# EAGLE board botball_v5 (EAGLE 6.5.0), part 1 of 5
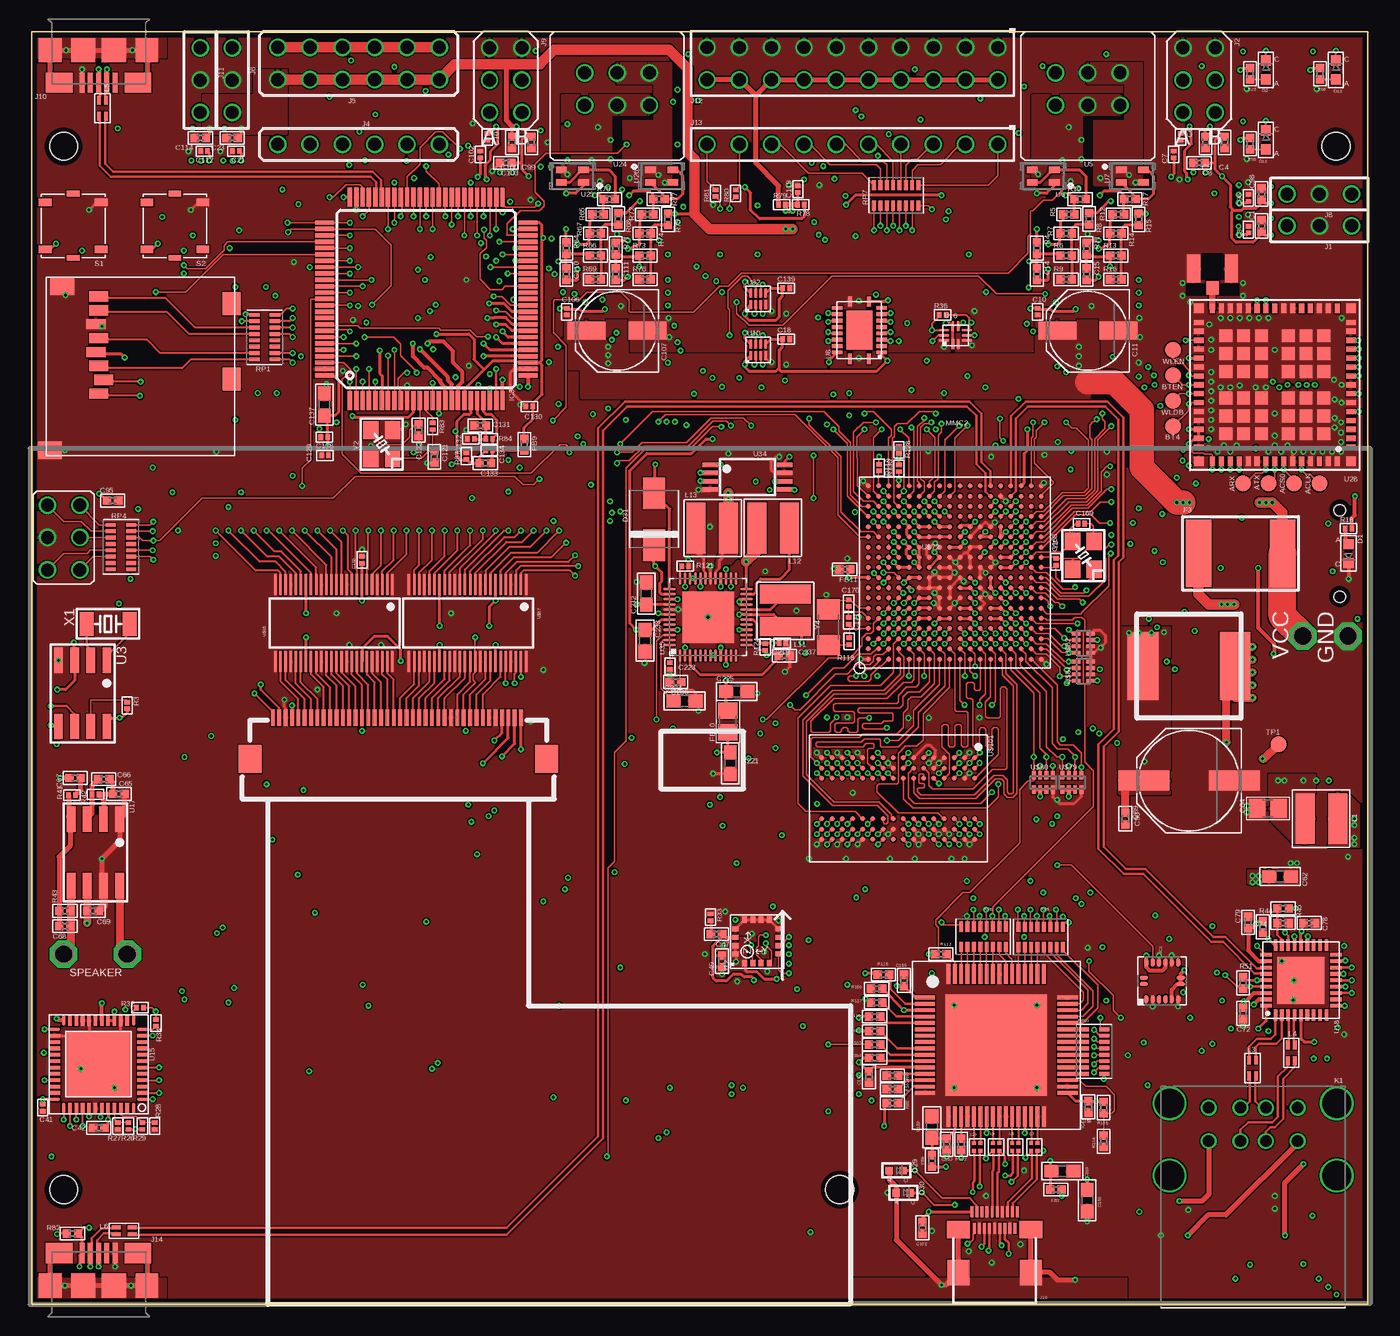
[diagram p44: board, top side]
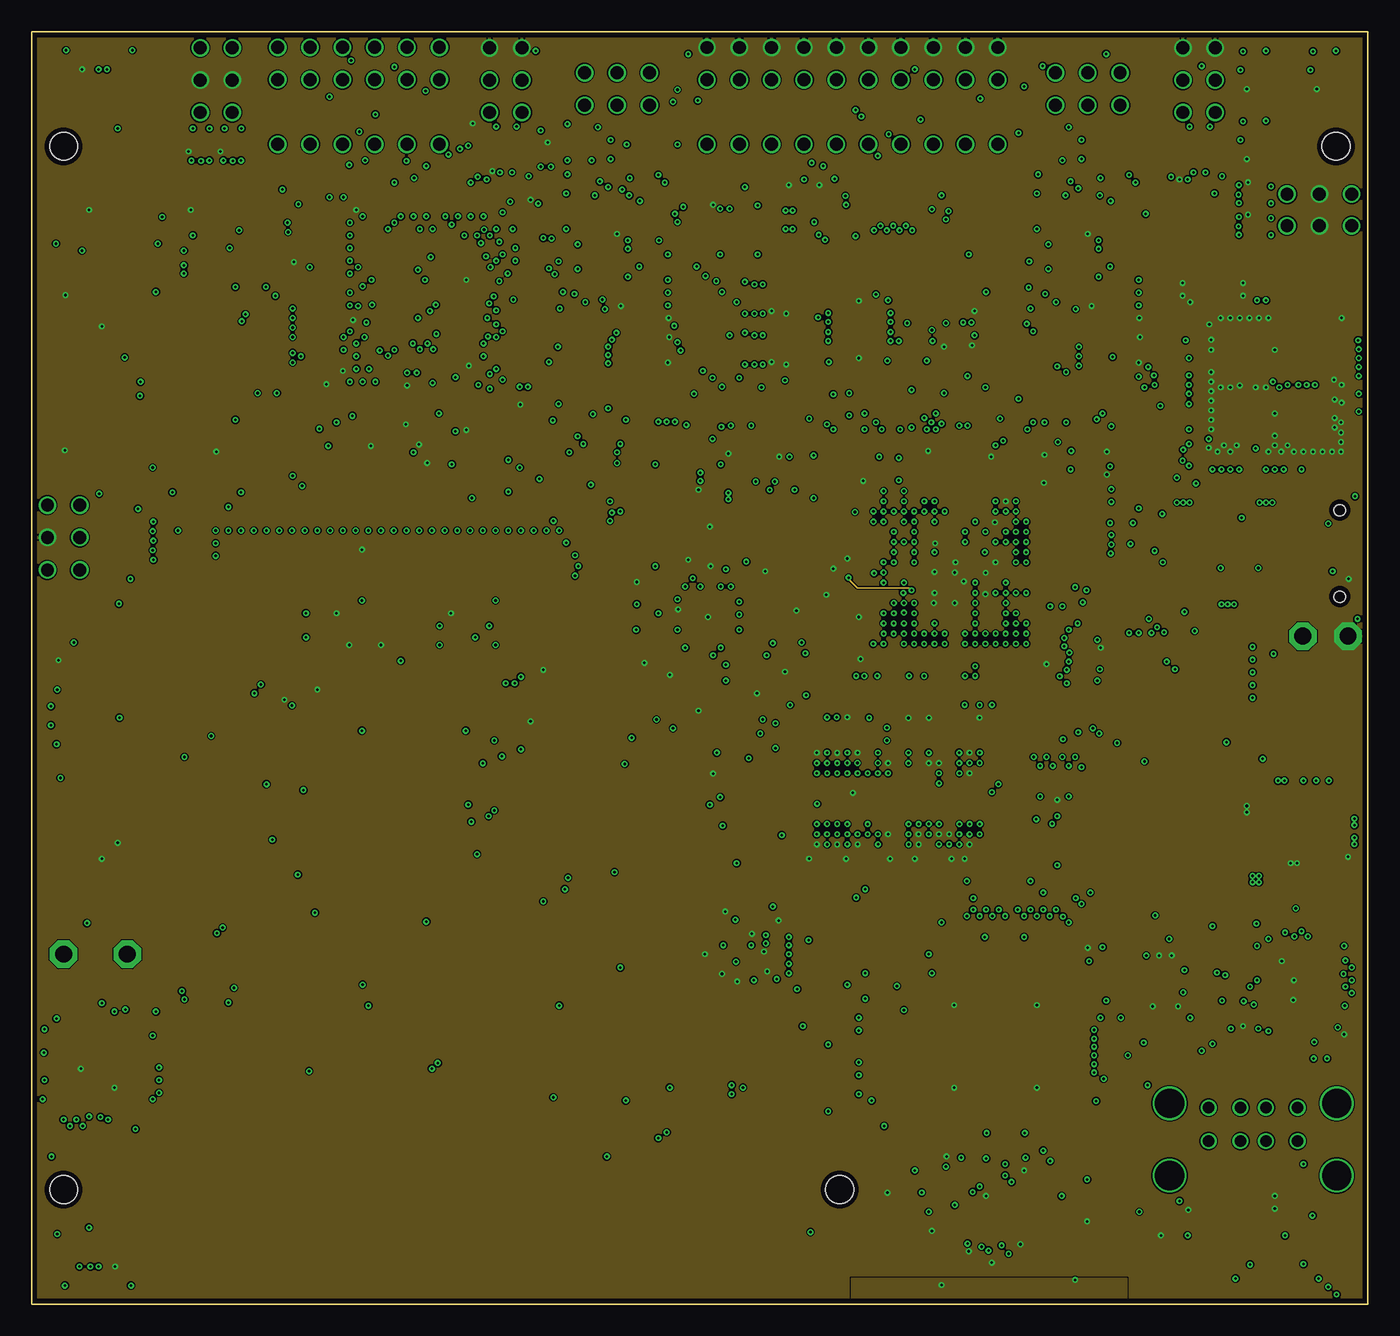
[diagram p45: board, inner layer GND]
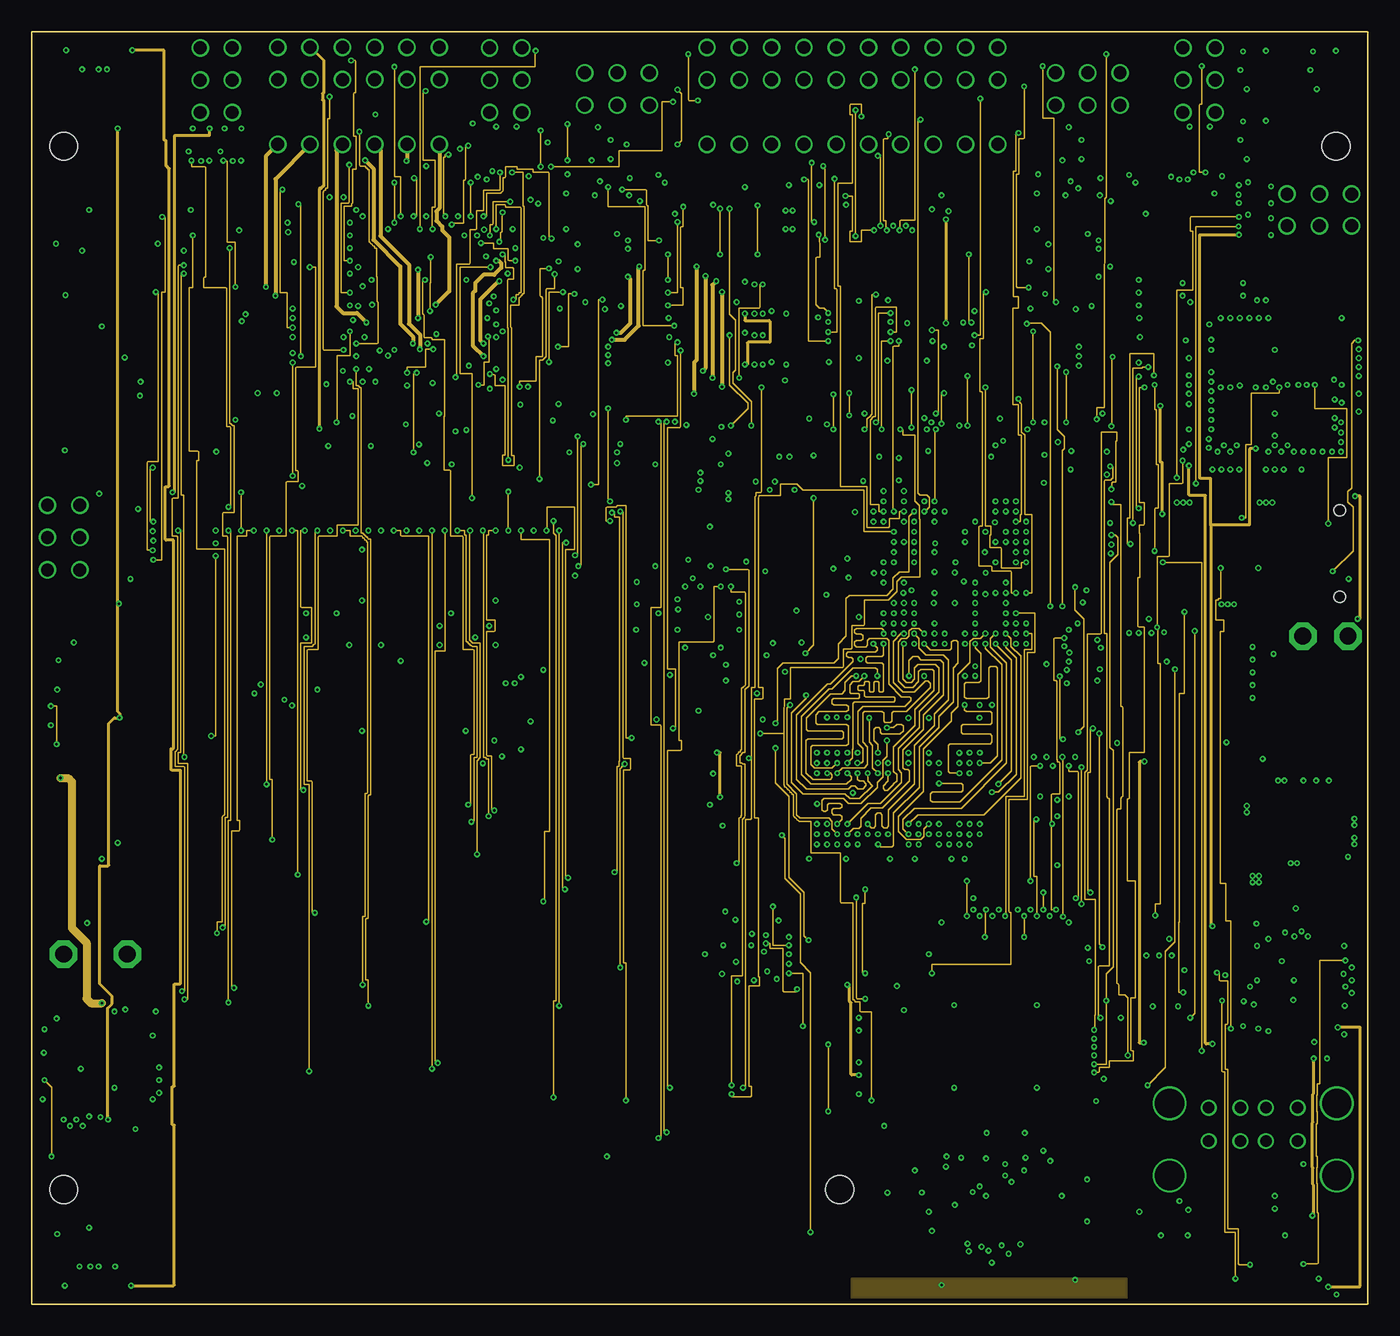
[diagram p46: board, inner layer S3]
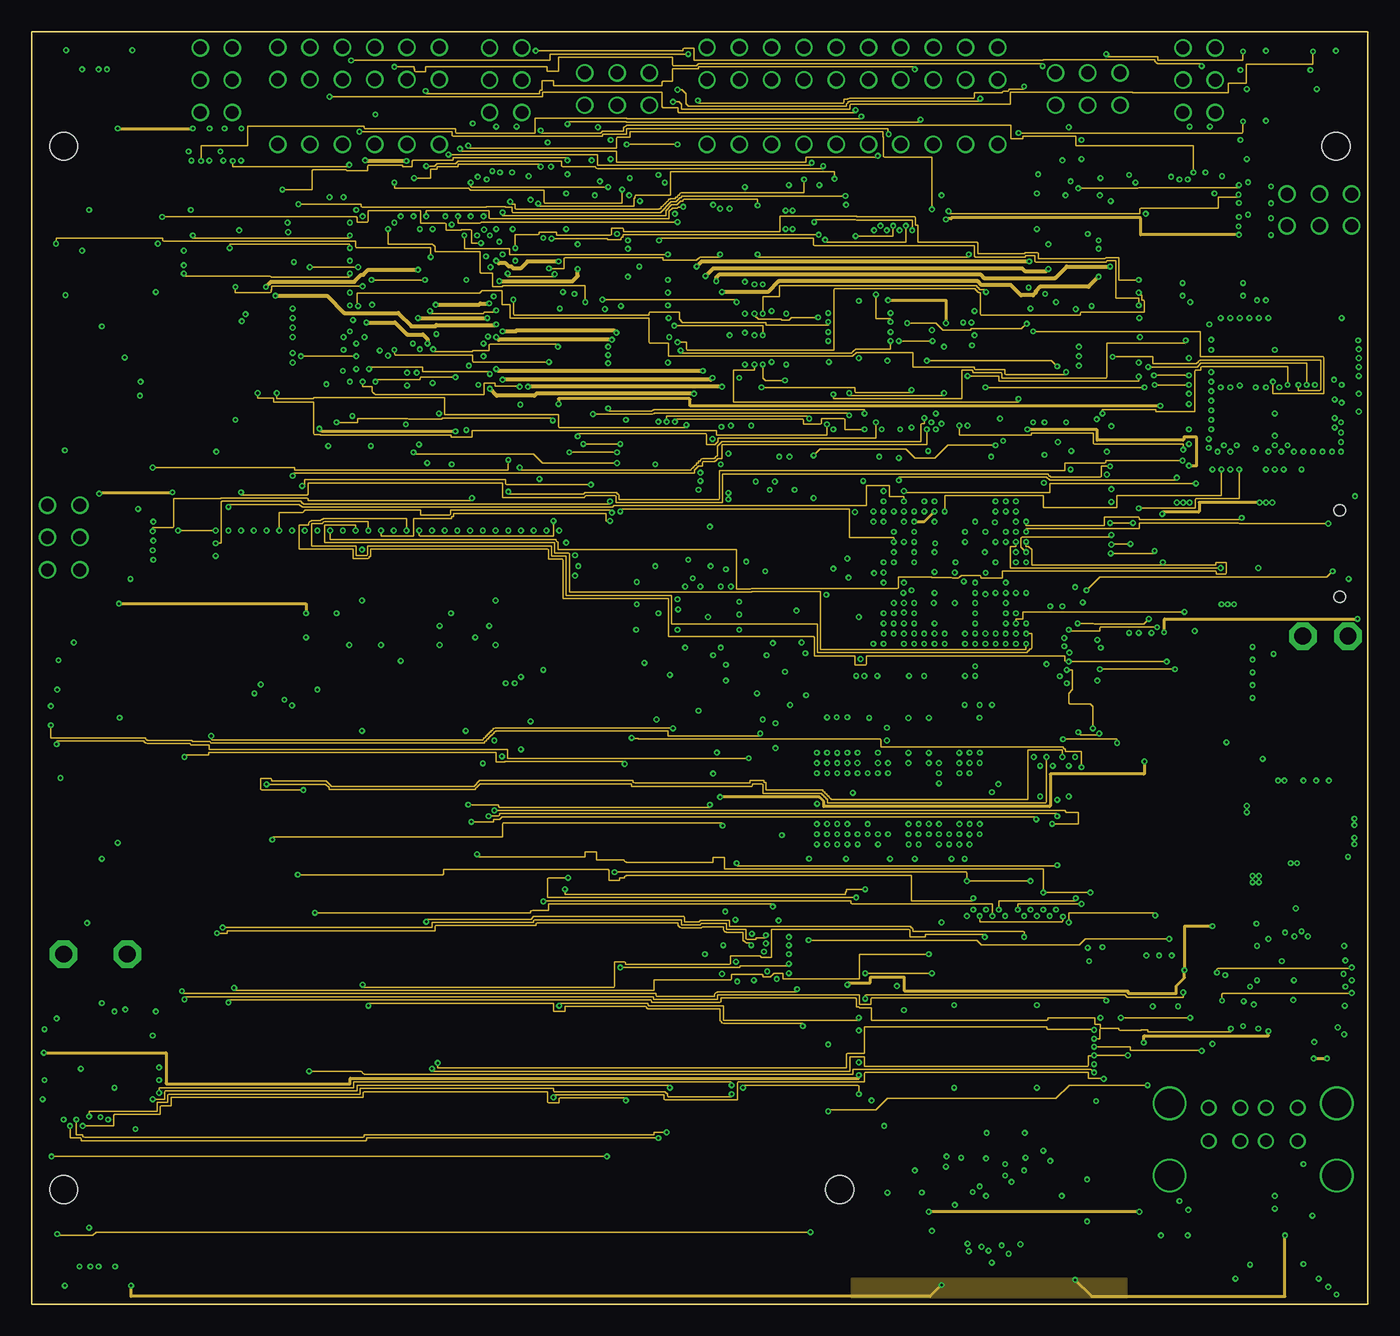
[diagram p47: board, inner layer S14]
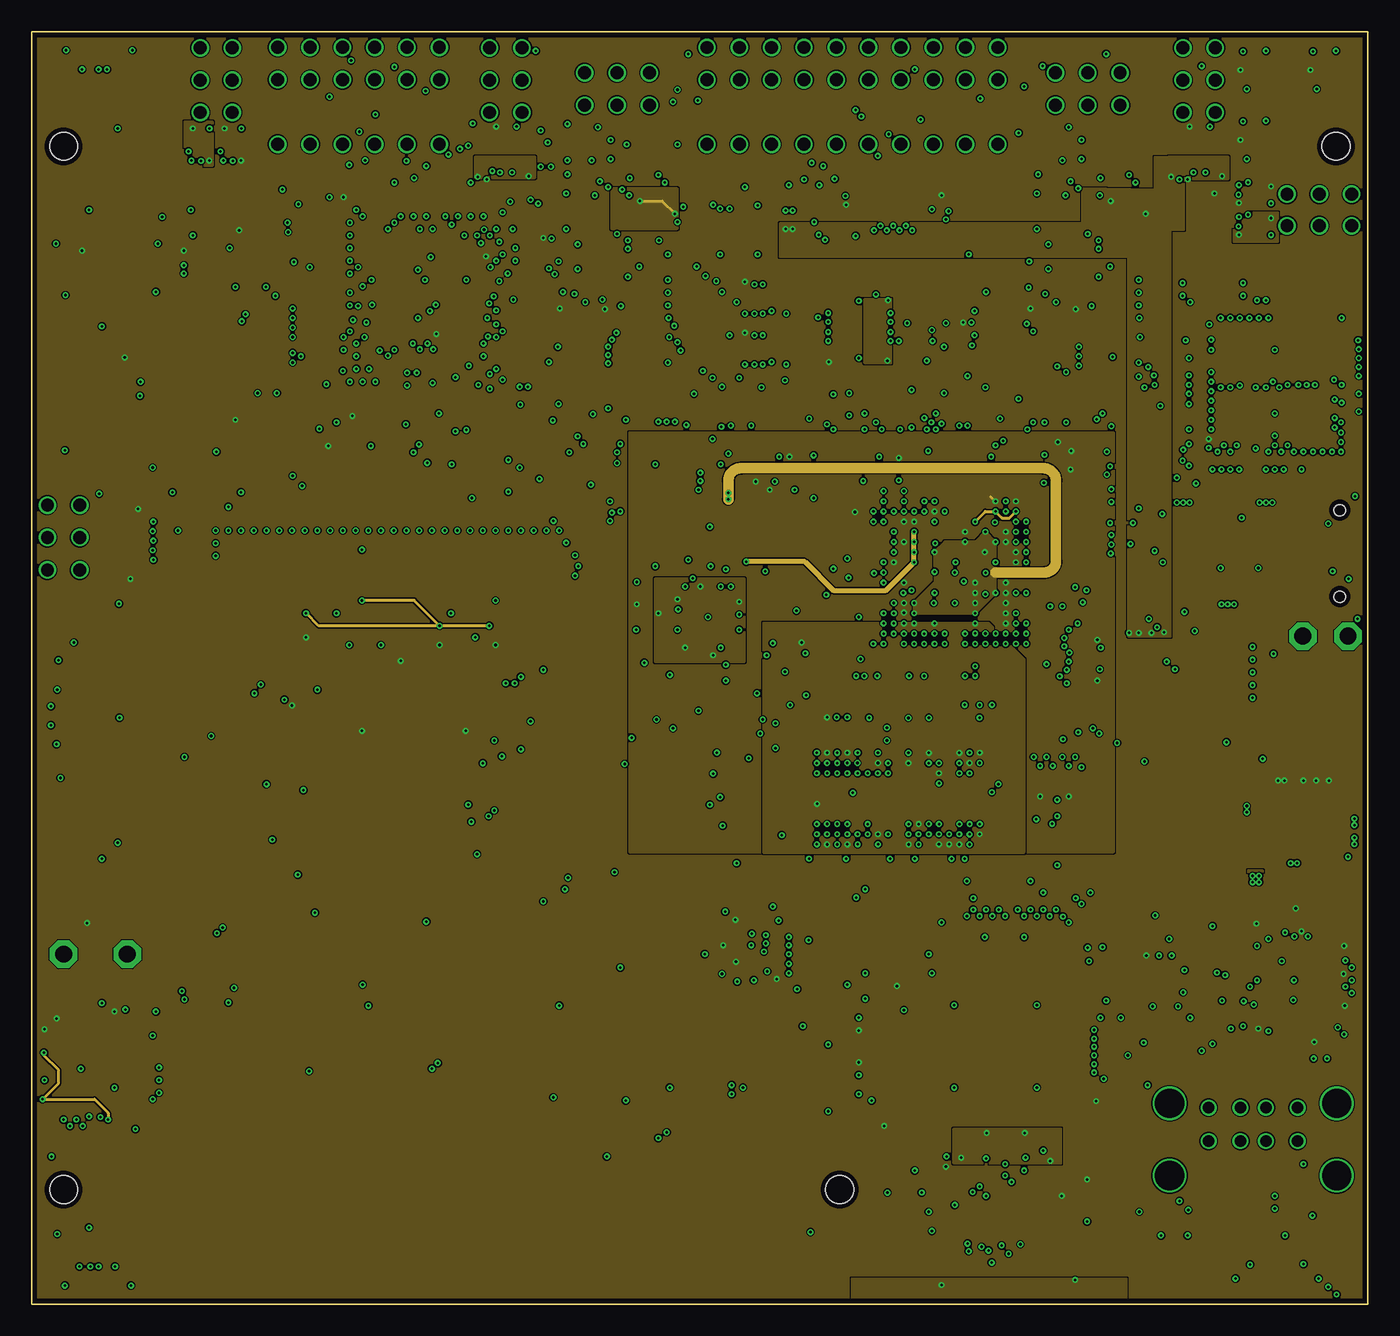
[diagram p48: board, inner layer Power]
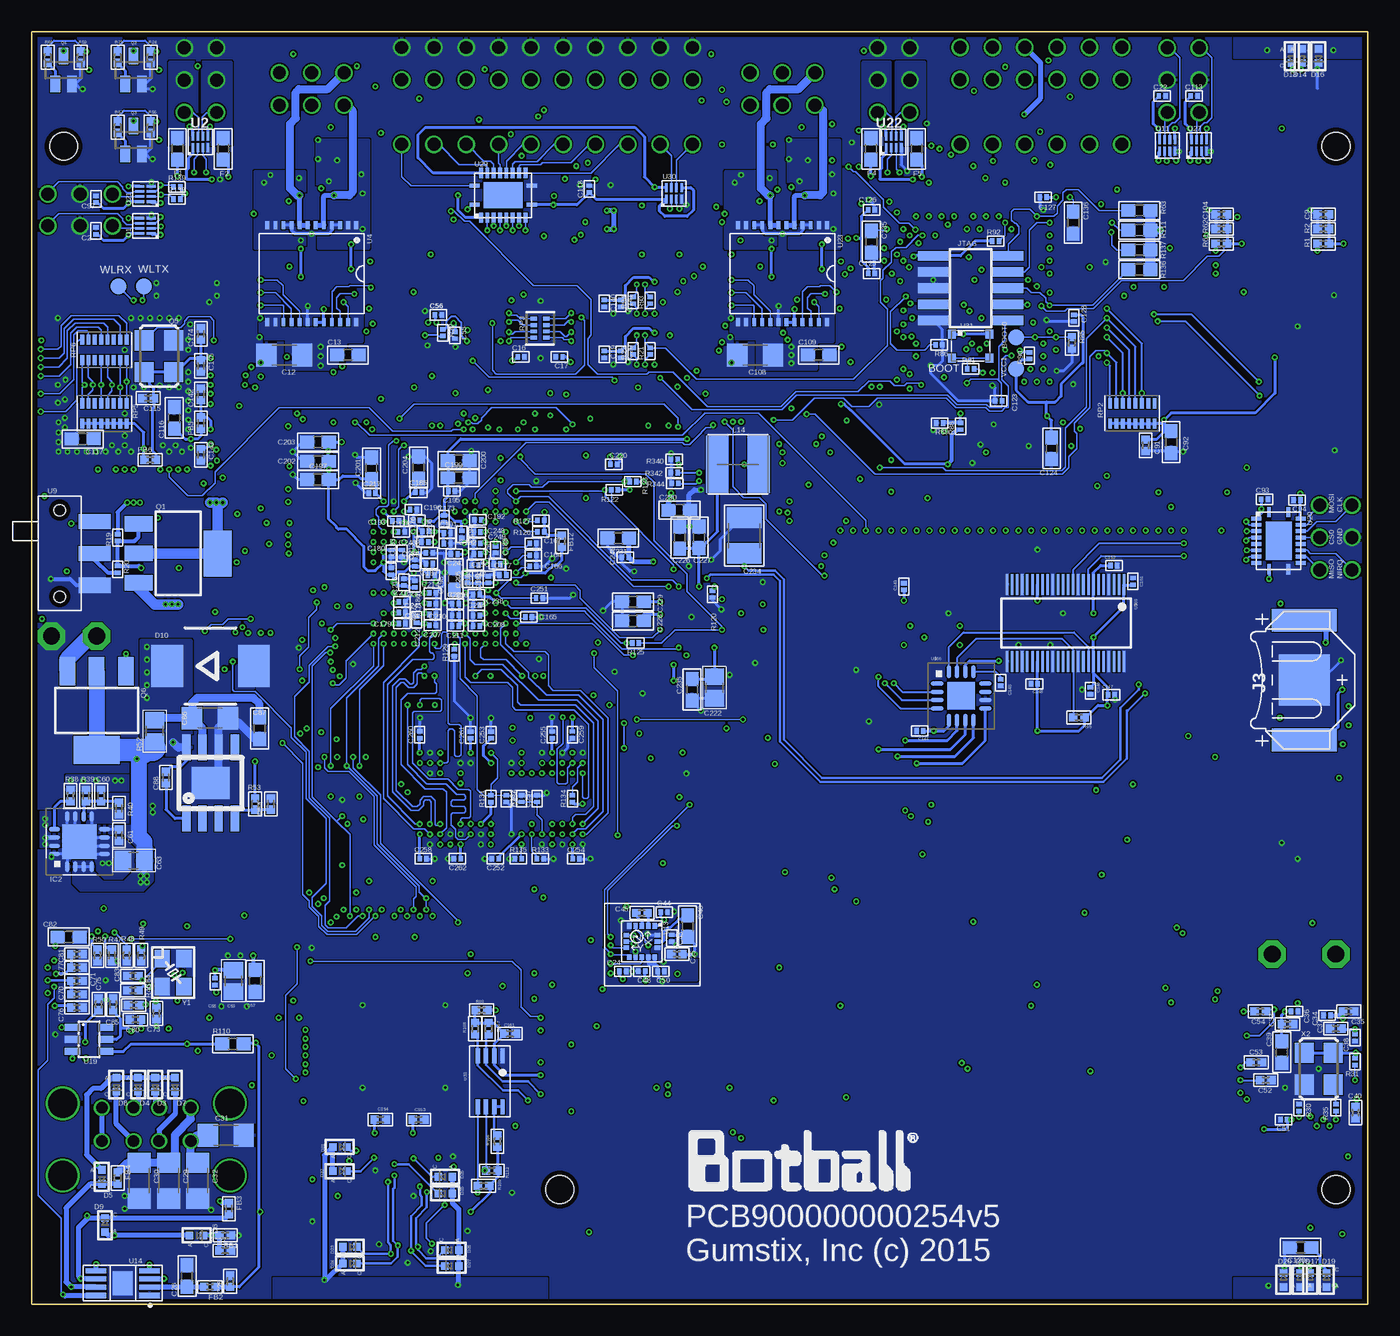
[diagram p49: board, bottom side, seen from below]

Size 105 x 100 mm. Coordinates in mm from the lower left corner, seen from the top.
Outline: 0,0 0,100 105,100 105,0 0,0
Copper layers (1+2*3+14*15+16): Top 0.035mm / dielectric 0.2mm / GND 0.035mm / dielectric 0.2mm / S3 0.035mm / dielectric 0.2mm / S14 0.035mm / dielectric 0.2mm / Power 0.035mm / dielectric 0.2mm / Bottom 0.035mm
Design rules "geppetto": minimum track width 4mil, minimum drill 8mil, track to track 4mil, track to pad 0.15mm, pad to pad 0.15mm, via to via 0.15mm, smd to smd 0mil, copper to edge 15mil, drill to drill 10mil, minimum pad ring 7mil, minimum via ring 5mil, stop-mask expansion 3mil, vias tented up to drill 20mil, thermal gap 0mil
Net classes: 1 supply: width 0.254 mm; 4 xxwide: width 0.203 mm; 5 USB: width 0.2 mm, clearance 0.2 mm; 6 HDMI: width 0.2 mm, clearance 0.3 mm
Holes 2.2 mm at 2.5,9 2.5,91 102.5,91 63.5,9
vRestrict: area 95.5,31.6 to 105,41.1; area 1,7.5 to 4,10.5; area 1,89.5 to 4,92.5; area 101,89.5 to 104,92.5; area 14.4,41.8 to 46.4,61.3; area 46.5,45.5 to 84.5,68.5; area 57.5,33.5 to 78,45.5

## Footprints (pad centres in the part's own frame; a part is rotated, then mirrored left to right if it is on the bottom)
TP0500 = smd 1.27 x 1.27: 1 0,0
0402 = smd 0.65 x 0.65: 1 -0.45,0; 2 0.45,0
0201 = smd 0.35 x 0.45: 1 -0.265,0; 2 0.265,0
PANASONIC_D = smd 3 x 1.4: + 2.4,0; - -2.4,0
1206 = smd 1.6 x 1.8: 1 -1.4,0; 2 1.4,0
0603 = smd 1.1 x 1: 1 -0.85,0; 2 0.85,0
0805 = smd 1.3 x 1.5: 1 -0.85,0; 2 0.85,0
PANASONIC_F = smd 4 x 1.6: + 3.55,0; - -3.55,0
1210 = smd 1.6 x 2.7: 1 -1.4,0; 2 1.4,0
U.FL = smd 1 x 1.05: 1 0,-1.525 | smd 1.05 x 2.2: 2 -1.475,0; 3 1.475,0
D0603 = smd 0.8 x 0.8: A -0.75,0; C 0.75,0
D0402 = smd 0.6 x 0.6: P1 0,-0.55; P2 0,0.55
DO-214AB = smd 2.5 x 3.3: A 3.4,0; C -3.4,0
SMAJ = smd 2.5 x 1.7: A 2.032,0; C -2.032,0
2920 = smd 2 x 5.3: 1 -3.3,0; 2 3.3,0
P1-13 = drill 1.321 pad 2.159 octagon: TP 0,0
EP-3X3MMQFN16 = smd 0.65 x 0.3: 1 -1.45,1.25; 2 -1.45,0.75; 3 -1.45,0.25; 4 -1.45,-0.25; 5 -1.45,-0.75; 6 -1.45,-1.25; 9 1.45,-1.25; 10 1.45,-0.75; 11 1.45,-0.25; 12 1.45,0.25; 13 1.45,0.75; 14 1.45,1.25 | smd 0.3 x 0.65: 7 -0.25,-1.45; 8 0.25,-1.45; 15 0.25,1.45; 16 -0.25,1.45
PQFP16 = smd 0.85 x 0.35: 1 -1.975,0.975; 2 -1.975,0.325; 3 -1.975,-0.325; 4 -1.975,-0.975; 9 1.975,-0.975; 10 1.975,-0.325; 11 1.975,0.325; 12 1.975,0.975 | smd 0.35 x 0.85: 5 -0.975,-1.975; 6 -0.325,-1.975; 7 0.325,-1.975; 8 0.975,-1.975; 13 0.975,1.975; 14 0.325,1.975; 15 -0.325,1.975; 16 -0.975,1.975 | smd 2.7 x 2.7: P$1 0,0
TQFP100 = smd 1.5 x 0.35: 1 -8,6; 2 -8,5.5; 3 -8,5; 4 -8,4.5; 5 -8,4; 6 -8,3.5; 7 -8,3; 8 -8,2.5; 9 -8,2; 10 -8,1.5; 11 -8,1; 12 -8,0.5; 13 -8,0; 14 -8,-0.5; 15 -8,-1; 16 -8,-1.5; 17 -8,-2; 18 -8,-2.5; 19 -8,-3; 20 -8,-3.5; 21 -8,-4; 22 -8,-4.5; 23 -8,-5; 24 -8,-5.5; 25 -8,-6; 51 8,-6; 52 8,-5.5; 53 8,-5; 54 8,-4.5; 55 8,-4; 56 8,-3.5; 57 8,-3; 58 8,-2.5; 59 8,-2; 60 8,-1.5; 61 8,-1; 62 8,-0.5; 63 8,0; 64 8,0.5; 65 8,1; 66 8,1.5; 67 8,2; 68 8,2.5; 69 8,3; 70 8,3.5; 71 8,4; 72 8,4.5; 73 8,5; 74 8,5.5; 75 8,6 | smd 0.35 x 1.5: 26 -6,-8; 27 -5.5,-8; 28 -5,-8; 29 -4.5,-8; 30 -4,-8; 31 -3.5,-8; 32 -3,-8; 33 -2.5,-8; 34 -2,-8; 35 -1.5,-8; 36 -1,-8; 37 -0.5,-8; 38 0,-8; 39 0.5,-8; 40 1,-8; 41 1.5,-8; 42 2,-8; 43 2.5,-8; 44 3,-8; 45 3.5,-8; 46 4,-8; 47 4.5,-8; 48 5,-8; 49 5.5,-8; 50 6,-8; 76 6,8; 77 5.5,8; 78 5,8; 79 4.5,8; 80 4,8; 81 3.5,8; 82 3,8; 83 2.5,8; 84 2,8; 85 1.5,8; 86 1,8; 87 0.5,8; 88 0,8; 89 -0.5,8; 90 -1,8; 91 -1.5,8; 92 -2,8; 93 -2.5,8; 94 -3,8; 95 -3.5,8; 96 -4,8; 97 -4.5,8; 98 -5,8; 99 -5.5,8; 100 -6,8
TQFP-64 = smd 1.6 x 0.3: 1 -5.6,3.75; 2 -5.6,3.25; 3 -5.6,2.75; 4 -5.6,2.25; 5 -5.6,1.75; 6 -5.6,1.25; 7 -5.6,0.75; 8 -5.6,0.25; 9 -5.6,-0.25; 10 -5.6,-0.75; 11 -5.6,-1.25; 12 -5.6,-1.75; 13 -5.6,-2.25; 14 -5.6,-2.75; 15 -5.6,-3.25; 16 -5.6,-3.75; 33 5.6,-3.75; 34 5.6,-3.25; 35 5.6,-2.75; 36 5.6,-2.25; 37 5.6,-1.75; 38 5.6,-1.25; 39 5.6,-0.75; 40 5.6,-0.25; 41 5.6,0.25; 42 5.6,0.75; 43 5.6,1.25; 44 5.6,1.75; 45 5.6,2.25; 46 5.6,2.75; 47 5.6,3.25; 48 5.6,3.75 | smd 0.3 x 1.6: 17 -3.75,-5.6; 18 -3.25,-5.6; 19 -2.75,-5.6; 20 -2.25,-5.6; 21 -1.75,-5.6; 22 -1.25,-5.6; 23 -0.75,-5.6; 24 -0.25,-5.6; 25 0.25,-5.6; 26 0.75,-5.6; 27 1.25,-5.6; 28 1.75,-5.6; 29 2.25,-5.6; 30 2.75,-5.6; 31 3.25,-5.6; 32 3.75,-5.6; 49 3.75,5.6; 50 3.25,5.6; 51 2.75,5.6; 52 2.25,5.6; 53 1.75,5.6; 54 1.25,5.6; 55 0.75,5.6; 56 0.25,5.6; 57 -0.25,5.6; 58 -0.75,5.6; 59 -1.25,5.6; 60 -1.75,5.6; 61 -2.25,5.6; 62 -2.75,5.6; 63 -3.25,5.6; 64 -3.75,5.6 | smd 8 x 8: TP 0,0
MA03-100 = drill 1.016: 1 -2.54,0; 2 0,0; 3 2.54,0
MA03-2 = drill 1.016: A1 -1.27,2.54; A2 -1.27,0; A3 -1.27,-2.54; B1 1.27,2.54; B2 1.27,0; B3 1.27,-2.54
BATTERY_6.8MM-2998 = smd 1.8 x 5.1: +1 4.7,0; +2 -4.7,0 | smd 4 x 4: - 0,0
1X06 = drill 1.016: 1 -6.35,0; 2 -3.81,0; 3 -1.27,0; 4 1.27,0; 5 3.81,0; 6 6.35,0
2X06 = drill 1.016: A1 -6.35,1.27; A2 -3.81,1.27; A3 -1.27,1.27; A4 1.27,1.27; A5 3.81,1.27; A6 6.35,1.27; B1 -6.35,-1.27; B2 -3.81,-1.27; B3 -1.27,-1.27; B4 1.27,-1.27; B5 3.81,-1.27; B6 6.35,-1.27
2X03 = drill 1.016: A1 -2.54,1.27; A2 0,1.27; A3 2.54,1.27; B1 -2.54,-1.27; B2 0,-1.27; B3 2.54,-1.27
USB_MICRO_B = smd 2.1 x 1.6: COMMON_SHEILD1 -3.1,4; COMMON_SHEILD2 3.1,4 | smd 1.8 x 1.9: COMMON_SHEILD3 -3.8,1.45; COMMON_SHEILD6 3.8,1.45 | smd 1.9 x 1.9: COMMON_SHEILD4 -1.2,1.45; COMMON_SHEILD5 1.2,1.45 | smd 0.4 x 1.6: P1 -1.3,4; P2 -0.65,4; P3 0,4; P4 0.65,4; P5 1.3,4
057-020-1 = drill 1.016: 1 -11.43,-1.27; 2 -11.43,1.27; 3 -8.89,-1.27; 4 -8.89,1.27; 5 -6.35,-1.27; 6 -6.35,1.27; 7 -3.81,-1.27; 8 -3.81,1.27; 9 -1.27,-1.27; 10 -1.27,1.27; 11 1.27,-1.27; 12 1.27,1.27; 13 3.81,-1.27; 14 3.81,1.27; 15 6.35,-1.27; 16 6.35,1.27; 17 8.89,-1.27; 18 8.89,1.27; 19 11.43,-1.27; 20 11.43,1.27
057-010-1 = drill 1.016: 1 -11.43,0; 2 -8.89,0; 3 -6.35,0; 4 -3.81,0; 5 -1.27,0; 6 1.27,0; 7 3.81,0; 8 6.35,0; 9 8.89,0; 10 11.43,0
46765-001 = smd 0.23 x 0.85: 1 1.8,7.175; 2 1.6,5.875; 3 1.4,7.175; 4 1.2,5.875; 5 1,7.175; 6 0.8,5.875; 7 0.6,7.175; 8 0.4,5.875; 9 0.2,7.175; 10 0,5.875; 11 -0.2,7.175; 12 -0.4,5.875; 13 -0.6,7.175; 14 -0.8,5.875; 15 -1,7.175; 16 -1.2,5.875; 17 -1.4,7.175; 18 -1.6,5.875; 19 -1.8,7.175 | smd 1.7 x 2: CON1 -2.85,2.4; CON2 2.85,2.4 | smd 1.8 x 1.38: CON3 2.85,5.76; CON4 -2.85,5.76
1365-10 = smd 0.76 x 2.4: 1 -2.54,-2.95; 2 -2.54,2.95; 3 -1.27,-2.95; 4 -1.27,2.95; 5 0,-2.95; 6 0,2.95; 7 1.27,-2.95; 8 1.27,2.95; 9 2.54,-2.95; 10 2.54,2.95
61400826021 = drill 2.3: 5 -6.57,5.68; 6 -6.57,0; 7 6.57,0; 8 6.57,5.68 | drill 0.9: A1 -3.5,5.33; A2 -1,5.33; A3 1,5.33; A4 3.5,5.33; B1 -3.5,2.71; B2 -1,2.71; B3 1,2.71; B4 3.5,2.71
1515 = smd 1.5 x 4: 1 -1.3,0; 2 1.25,0
3232DZ = smd 2.413 x 5.334: 1 -3.619,0; 2 3.619,0
0504-DLP11S = smd 0.7 x 0.3: 1 -0.625,0.275; 2 0.625,0.275; 3 0.625,-0.275; 4 -0.625,-0.275
03025-DLP0NS = smd 0.3 x 0.3: 1 -0.3,0.25; 2 0.3,0.25; 3 0.3,-0.25; 4 -0.3,-0.25
WE-PD2_4532 = smd 1.75 x 4.5: 1 -1.625,0; 2 1.625,0
SOT223 = smd 1.219 x 2.235: 1 -2.311,-3.099; 2 0,-3.099; 3 2.311,-3.099 | smd 3.6 x 2.2: 4 0,3.099
SOT23 = smd 0.762 x 1.27: 1 -0.66,-1.1; 2 0.66,-1.1; 3 0,1.1
ASF = smd 1.6 x 1.5: 1 -1.25,-1.15; 2 1.25,-1.15; 3 1.25,1.15; 4 -1.25,1.15
741X16 = smd 0.8 x 0.3: 1 -0.8,1.75; 2 -0.8,1.25; 3 -0.8,0.75; 4 -0.8,0.25; 5 -0.8,-0.25; 6 -0.8,-0.75; 7 -0.8,-1.25; 8 -0.8,-1.75; 9 0.8,-1.75; 10 0.8,-1.25; 11 0.8,-0.75; 12 0.8,-0.25; 13 0.8,0.25; 14 0.8,0.75; 15 0.8,1.25; 16 0.8,1.75
741X08 = smd 0.3 x 0.5: 1 -0.75,-0.5; 2 -0.25,-0.5; 3 0.25,-0.5; 4 0.75,-0.5; 5 0.75,0.5; 6 0.25,0.5; 7 -0.25,0.5; 8 -0.75,0.5
EVQ = smd 0.6 x 1: A@1 -1.85,2.2; A@2 -1.85,-2.2; B@1 1.85,2.2; B@2 1.85,-2.2 | smd 0.45 x 1: G@1 -2.525,0; G@2 2.525,0
DFN8-0.4P = smd 0.2 x 0.7: 1 -0.6,-0.45; 2 -0.2,-0.45; 3 0.2,-0.45; 4 0.6,-0.45; 5 0.6,0.45; 6 0.2,0.45; 7 -0.2,0.45; 8 -0.6,0.45
SO-8 = smd 2 x 0.7: 1 -2.6,1.905; 2 -2.6,0.635; 3 -2.6,-0.635; 4 -2.6,-1.905; 5 2.6,-1.905; 6 2.6,-0.635; 7 2.6,0.635; 8 2.6,1.905
SSOP24 = smd 0.305 x 0.61: 1 -3.493,-3.81; 2 -2.857,-3.81; 3 -2.223,-3.81; 4 -1.587,-3.81; 5 -0.953,-3.81; 6 -0.318,-3.81; 7 0.318,-3.81; 8 0.953,-3.81; 9 1.587,-3.81; 10 2.223,-3.81; 11 2.857,-3.81; 12 3.493,-3.81; 13 3.493,3.81; 14 2.857,3.81; 15 2.223,3.81; 16 1.587,3.81; 17 0.953,3.81; 18 0.318,3.81; 19 -0.318,3.81; 20 -0.953,3.81; 21 -1.587,3.81; 22 -2.223,3.81; 23 -2.857,3.81; 24 -3.493,3.81
2X03_SHROUD = drill 1.016: A1 -2.54,1.27; A2 0,1.27; A3 2.54,1.27; B1 -2.54,-1.27; B2 0,-1.27; B3 2.54,-1.27
APTB1615 = smd 0.85 x 0.5: 1 0.875,-0.5; 2 -0.875,-0.5; 3 0.875,0.5; 4 -0.875,0.5
QFN20 = smd 0.8 x 0.3: 1 -2.25,-0.75; 10 2.25,-0.75; 11 2.25,0.75; 20 -2.25,0.75 | smd 0.3 x 0.8: 2 -1.75,-1.75; 3 -1.25,-1.75; 4 -0.75,-1.75; 5 -0.25,-1.75; 6 0.25,-1.75; 7 0.75,-1.75; 8 1.25,-1.75; 9 1.75,-1.75; 12 1.75,1.75; 13 1.25,1.75; 14 0.75,1.75; 15 0.25,1.75; 16 -0.25,1.75; 17 -0.75,1.75; 18 -1.25,1.75; 19 -1.75,1.75 | smd 3.05 x 2.05: 21 0,0
JS102011SAQN = smd 1.2 x 2.5: 1 -2.5,2.75; 2 0,2.75; 3 2.5,2.75 | hole 0.9: 3.4,0; -3.4,0
LGA16-4X4MM = smd 0.5 x 0.4: 1 -1.7,0.975; 2 -1.7,0.325; 3 -1.7,-0.325; 4 -1.7,-0.975; 9 1.7,-0.975; 10 1.7,-0.325; 11 1.7,0.325; 12 1.7,0.975 | smd 0.4 x 0.5: 5 -0.975,-1.7; 6 -0.325,-1.7; 7 0.325,-1.7; 8 0.975,-1.7; 13 0.975,1.7; 14 0.325,1.7; 15 -0.325,1.7; 16 -0.975,1.7
LGA16-3X3MM = smd 0.45 x 0.35: 1 -1.225,1; 2 -1.225,0.5; 3 -1.225,0; 4 -1.225,-0.5; 5 -1.225,-1; 9 1.225,-1; 10 1.225,-0.5; 11 1.225,0; 12 1.225,0.5; 13 1.225,1 | smd 0.35 x 0.45: 6 -0.5,-1.225; 7 0,-1.225; 8 0.5,-1.225; 14 0.5,1.225; 15 0,1.225; 16 -0.5,1.225
MSOP8-PAD = smd 0.4 x 1.6: 1 -0.975,-2.1; 2 -0.325,-2.1; 3 0.325,-2.1; 4 0.975,-2.1; 5 0.975,2.1; 6 0.325,2.1; 7 -0.325,2.1; 8 -0.975,2.1 | smd 1.89 x 1.57: TP 0,0
QFN48 = smd 0.85 x 0.28: 1 -3.45,2.75; 2 -3.45,2.25; 3 -3.45,1.75; 4 -3.45,1.25; 5 -3.45,0.75; 6 -3.45,0.25; 7 -3.45,-0.25; 8 -3.45,-0.75; 9 -3.45,-1.25; 10 -3.45,-1.75; 11 -3.45,-2.25; 12 -3.45,-2.75; 25 3.45,-2.75; 26 3.45,-2.25; 27 3.45,-1.75; 28 3.45,-1.25; 29 3.45,-0.75; 30 3.45,-0.25; 31 3.45,0.25; 32 3.45,0.75; 33 3.45,1.25; 34 3.45,1.75; 35 3.45,2.25; 36 3.45,2.75 | smd 0.28 x 0.85: 13 -2.75,-3.45; 14 -2.25,-3.45; 15 -1.75,-3.45; 16 -1.25,-3.45; 17 -0.75,-3.45; 18 -0.25,-3.45; 19 0.25,-3.45; 20 0.75,-3.45; 21 1.25,-3.45; 22 1.75,-3.45; 23 2.25,-3.45; 24 2.75,-3.45; 37 2.75,3.45; 38 2.25,3.45; 39 1.75,3.45; 40 1.25,3.45; 41 0.75,3.45; 42 0.25,3.45; 43 -0.25,3.45; 44 -0.75,3.45; 45 -1.25,3.45; 46 -1.75,3.45; 47 -2.25,3.45; 48 -2.75,3.45 | smd 5.15 x 5.15: 49 0,0
UQFN-10 = smd 0.2 x 0.8: 1 -0.2,-0.7; 2 0.2,-0.7; 6 0.2,0.7; 7 -0.2,0.7 | smd 0.8 x 0.2: 3 0.9,-0.4; 4 0.9,0; 5 0.9,0.4; 8 -0.9,0.4; 9 -0.9,0; 10 -0.9,-0.4
QFN36-6X6MM = smd 0.9 x 0.28: 1 -2.75,2; 2 -2.75,1.5; 3 -2.75,1; 4 -2.75,0.5; 5 -2.75,0; 6 -2.75,-0.5; 7 -2.75,-1; 8 -2.75,-1.5; 9 -2.75,-2; 19 2.75,-2; 20 2.75,-1.5; 21 2.75,-1; 22 2.75,-0.5; 23 2.75,0; 24 2.75,0.5; 25 2.75,1; 26 2.75,1.5; 27 2.75,2 | smd 0.28 x 0.9: 10 -2,-2.75; 11 -1.5,-2.75; 12 -1,-2.75; 13 -0.5,-2.75; 14 0,-2.75; 15 0.5,-2.75; 16 1,-2.75; 17 1.5,-2.75; 18 2,-2.75; 28 2,2.75; 29 1.5,2.75; 30 1,2.75; 31 0.5,2.75; 32 0,2.75; 33 -0.5,2.75; 34 -1,2.75; 35 -1.5,2.75; 36 -2,2.75 | smd 3.7 x 3.7: EPAD 0,0
SOT-23-6 = smd 0.55 x 1.2: 1 -0.95,-1.3; 2 0,-1.3; 3 0.95,-1.3; 4 0.95,1.3; 5 0,1.3; 6 -0.95,1.3
WL1801MOD = smd 0.75 x 0.75: 1 -6.025,-5.975; 17 6.025,-5.975; 33 6.025,5.975; 49 -6.025,5.975 | smd 0.4 x 0.75: 2 -4.9,-5.975; 3 -4.2,-5.975; 4 -3.5,-5.975; 5 -2.8,-5.975; 6 -2.1,-5.975; 7 -1.4,-5.975; 8 -0.7,-5.975; 9 0,-5.975; 10 0.7,-5.975; 11 1.4,-5.975; 12 2.1,-5.975; 13 2.8,-5.975; 14 3.5,-5.975; 15 4.2,-5.975; 16 4.9,-5.975; 34 4.9,5.975; 35 4.2,5.975; 36 3.5,5.975; 37 2.8,5.975; 38 2.1,5.975; 39 1.4,5.975; 40 0.7,5.975; 41 0,5.975; 42 -0.7,5.975; 43 -1.4,5.975; 44 -2.1,5.975; 45 -2.8,5.975; 46 -3.5,5.975; 47 -4.2,5.975; 48 -4.9,5.975 | smd 0.75 x 0.4: 18 6.025,-4.9; 19 6.025,-4.2; 20 6.025,-3.5; 21 6.025,-2.8; 22 6.025,-2.1; 23 6.025,-1.4; 24 6.025,-0.7; 25 6.025,0; 26 6.025,0.7; 27 6.025,1.4; 28 6.025,2.1; 29 6.025,2.8; 30 6.025,3.5; 31 6.025,4.2; 32 6.025,4.9; 50 -6.025,4.9; 51 -6.025,4.2; 52 -6.025,3.5; 53 -6.025,2.8; 54 -6.025,2.1; 55 -6.025,1.4; 56 -6.025,0.7; 57 -6.025,0; 58 -6.025,-0.7; 59 -6.025,-1.4; 60 -6.025,-2.1; 61 -6.025,-2.8; 62 -6.025,-3.5; 63 -6.025,-4.2; 64 -6.025,-4.9 | smd 1 x 1: G1 -3.85,3.85; G2 -2.45,3.85; G3 -1.05,3.85; G4 1.05,3.85; G5 2.45,3.85; G6 3.85,3.85; G7 -3.85,2.45; G8 -2.45,2.45; G9 -1.05,2.45; G10 1.05,2.45; G11 2.45,2.45; G12 3.85,2.45; G13 -3.85,1.05; G14 -2.45,1.05; G15 -1.05,1.05; G16 1.05,1.05; G17 2.45,1.05; G18 3.85,1.05; G19 -3.85,-1.05; G20 -2.45,-1.05; G21 -1.05,-1.05; G22 1.05,-1.05; G23 2.45,-1.05; G24 3.85,-1.05; G25 -3.85,-2.45; G26 -2.45,-2.45; G27 -1.05,-2.45; G28 1.05,-2.45; G29 2.45,-2.45; G30 3.85,-2.45; G31 -3.85,-3.85; G32 -2.45,-3.85; G33 -1.05,-3.85; G34 1.05,-3.85; G35 2.45,-3.85; G36 3.85,-3.85
KMT0 = smd 0.65 x 0.7: 1 -1.475,0.95; 2 1.475,0.95; 3 1.475,-0.95; 4 -1.475,-0.95
DCT-8(SSOP) = smd 1.2 x 0.35: 1 -2,1; 2 -2,0.35; 3 -2,-0.3; 4 -2,-0.95; 5 2,-0.95; 6 2,-0.3; 7 2,0.35; 8 2,1
TSSOP8 = smd 0.35 x 1.2: 1 -0.975,-2.925; 2 -0.325,-2.925; 3 0.325,-2.925; 4 0.975,-2.925; 5 0.975,2.925; 6 0.325,2.925; 7 -0.325,2.925; 8 -0.975,2.925
QFN40P600X600X100-49 = smd 0.95 x 0.2: 1 -3.025,2.2; 2 -3.025,1.8; 3 -3.025,1.4; 4 -3.025,1; 5 -3.025,0.6; 6 -3.025,0.2; 7 -3.025,-0.2; 8 -3.025,-0.6; 9 -3.025,-1; 10 -3.025,-1.4; 11 -3.025,-1.8; 12 -3.025,-2.2; 25 3.025,-2.2; 26 3.025,-1.8; 27 3.025,-1.4; 28 3.025,-1; 29 3.025,-0.6; 30 3.025,-0.2; 31 3.025,0.2; 32 3.025,0.6; 33 3.025,1; 34 3.025,1.4; 35 3.025,1.8; 36 3.025,2.2 | smd 0.2 x 0.95: 13 -2.2,-3.025; 14 -1.8,-3.025; 15 -1.4,-3.025; 16 -1,-3.025; 17 -0.6,-3.025; 18 -0.2,-3.025; 19 0.2,-3.025; 20 0.6,-3.025; 21 1,-3.025; 22 1.4,-3.025; 23 1.8,-3.025; 24 2.2,-3.025; 37 2.2,3.025; 38 1.8,3.025; 39 1.4,3.025; 40 1,3.025; 41 0.6,3.025; 42 0.2,3.025; 43 -0.2,3.025; 44 -0.6,3.025; 45 -1,3.025; 46 -1.4,3.025; 47 -1.8,3.025; 48 -2.2,3.025 | smd 4.05 x 4.05: 49 0,0
8SO_POWERPAD = smd 2.05 x 0.66: 1 -2.79,1.905; 2 -2.79,0.635; 3 -2.79,-0.635; 4 -2.79,-1.905; 5 2.79,-1.905; 6 2.79,-0.635; 7 2.79,0.635; 8 2.79,1.905 | smd 2.5 x 3: 9 0,0
USD = smd 0.8 x 1.5: 1 -9.144,10.706; 2 -8.052,10.3; 3 -6.96,10.706; 4 -5.867,10.909; 5 -4.775,10.706; 6 -3.683,10.909; 7 -2.591,10.706; 8 -1.499,10.706 | smd 1.8 x 1.4: CD1 -2.07,0.25; CD2 -8.014,0.25 | smd 1.4 x 1.9: GND1 -13.602,14.55; GND3 -0.699,13.548
QFN16 = smd 1 x 0.35: 1 -1.9,0.975; 2 -1.9,0.325; 3 -1.9,-0.325; 4 -1.9,-0.975; 9 1.9,-0.975; 10 1.9,-0.325; 11 1.9,0.325; 12 1.9,0.975 | smd 0.35 x 1: 5 -0.975,-1.9; 6 -0.325,-1.9; 7 0.325,-1.9; 8 0.975,-1.9; 13 0.975,1.9; 14 0.325,1.9; 15 -0.325,1.9; 16 -0.975,1.9 | smd 2.16 x 2.16: P$1 0,0
TVSOP48 = smd 0.2 x 1.65: 1 -4.6,-3.025; 2 -4.2,-3.025; 3 -3.8,-3.025; 4 -3.4,-3.025; 5 -3,-3.025; 6 -2.6,-3.025; 7 -2.2,-3.025; 8 -1.8,-3.025; 9 -1.4,-3.025; 10 -1,-3.025; 11 -0.6,-3.025; 12 -0.2,-3.025; 13 0.2,-3.025; 14 0.6,-3.025; 15 1,-3.025; 16 1.4,-3.025; 17 1.8,-3.025; 18 2.2,-3.025; 19 2.6,-3.025; 20 3,-3.025; 21 3.4,-3.025; 22 3.8,-3.025; 23 4.2,-3.025; 24 4.6,-3.025; 25 4.6,3.025; 26 4.2,3.025; 27 3.8,3.025; 28 3.4,3.025; 29 3,3.025; 30 2.6,3.025; 31 2.2,3.025; 32 1.8,3.025; 33 1.4,3.025; 34 1,3.025; 35 0.6,3.025; 36 0.2,3.025; 37 -0.2,3.025; 38 -0.6,3.025; 39 -1,3.025; 40 -1.4,3.025; 41 -1.8,3.025; 42 -2.2,3.025; 43 -2.6,3.025; 44 -3,3.025; 45 -3.4,3.025; 46 -3.8,3.025; 47 -4.2,3.025; 48 -4.6,3.025
FH12-40S-0.5SH = smd 0.3 x 1.3: 1 -9.75,2.5; 2 -9.25,2.5; 3 -8.75,2.5; 4 -8.25,2.5; 5 -7.75,2.5; 6 -7.25,2.5; 7 -6.75,2.5; 8 -6.25,2.5; 9 -5.75,2.5; 10 -5.25,2.5; 11 -4.75,2.5; 12 -4.25,2.5; 13 -3.75,2.5; 14 -3.25,2.5; 15 -2.75,2.5; 16 -2.25,2.5; 17 -1.75,2.5; 18 -1.25,2.5; 19 -0.75,2.5; 20 -0.25,2.5; 21 0.25,2.5; 22 0.75,2.5; 23 1.25,2.5; 24 1.75,2.5; 25 2.25,2.5; 26 2.75,2.5; 27 3.25,2.5; 28 3.75,2.5; 29 4.25,2.5; 30 4.75,2.5; 31 5.25,2.5; 32 5.75,2.5; 33 6.25,2.5; 34 6.75,2.5; 35 7.25,2.5; 36 7.75,2.5; 37 8.25,2.5; 38 8.75,2.5; 39 9.25,2.5; 40 9.75,2.5 | smd 1.8 x 2.2: CON01 11.75,-0.75; CON02 -11.55,-0.75
BGA324C80P18X18 = smd 0.4 x 0.4: A1 -6.8,-6.8; A2 -6.8,-6; A3 -6.8,-5.2; A4 -6.8,-4.4; A5 -6.8,-3.6; A6 -6.8,-2.8; A7 -6.8,-2; A8 -6.8,-1.2; A9 -6.8,-0.4; A10 -6.8,0.4; A11 -6.8,1.2; A12 -6.8,2; A13 -6.8,2.8; A14 -6.8,3.6; A15 -6.8,4.4; A16 -6.8,5.2; A17 -6.8,6; A18 -6.8,6.8; B1 -6,-6.8; B2 -6,-6; B3 -6,-5.2; B4 -6,-4.4; B5 -6,-3.6; B6 -6,-2.8; B7 -6,-2; B8 -6,-1.2; B9 -6,-0.4; B10 -6,0.4; B11 -6,1.2; B12 -6,2; B13 -6,2.8; B14 -6,3.6; B15 -6,4.4; B16 -6,5.2; B17 -6,6; B18 -6,6.8; C1 -5.2,-6.8; C2 -5.2,-6; C3 -5.2,-5.2; C4 -5.2,-4.4; C5 -5.2,-3.6; C6 -5.2,-2.8; C7 -5.2,-2; C8 -5.2,-1.2; C9 -5.2,-0.4; C10 -5.2,0.4; C11 -5.2,1.2; C12 -5.2,2; C13 -5.2,2.8; C14 -5.2,3.6; C15 -5.2,4.4; C16 -5.2,5.2; C17 -5.2,6; C18 -5.2,6.8; D1 -4.4,-6.8; D2 -4.4,-6; D3 -4.4,-5.2; D4 -4.4,-4.4; D5 -4.4,-3.6; D6 -4.4,-2.8; D7 -4.4,-2; D8 -4.4,-1.2; D9 -4.4,-0.4; D10 -4.4,0.4; D11 -4.4,1.2; D12 -4.4,2; D13 -4.4,2.8; D14 -4.4,3.6; D15 -4.4,4.4; D16 -4.4,5.2; D17 -4.4,6; D18 -4.4,6.8; E1 -3.6,-6.8; E2 -3.6,-6; E3 -3.6,-5.2; E4 -3.6,-4.4; E5 -3.6,-3.6; E6 -3.6,-2.8; E7 -3.6,-2; E8 -3.6,-1.2; E9 -3.6,-0.4; E10 -3.6,0.4; E11 -3.6,1.2; E12 -3.6,2; E13 -3.6,2.8; E14 -3.6,3.6; E15 -3.6,4.4; E16 -3.6,5.2; E17 -3.6,6; E18 -3.6,6.8; F1 -2.8,-6.8; F2 -2.8,-6; F3 -2.8,-5.2; F4 -2.8,-4.4; F5 -2.8,-3.6; F6 -2.8,-2.8; F7 -2.8,-2; F8 -2.8,-1.2; F9 -2.8,-0.4; F10 -2.8,0.4; F11 -2.8,1.2; F12 -2.8,2; F13 -2.8,2.8; F14 -2.8,3.6; F15 -2.8,4.4; F16 -2.8,5.2; F17 -2.8,6; F18 -2.8,6.8; G1 -2,-6.8; G2 -2,-6; G3 -2,-5.2; G4 -2,-4.4; G5 -2,-3.6; G6 -2,-2.8; G7 -2,-2; G8 -2,-1.2; G9 -2,-0.4; G10 -2,0.4; G11 -2,1.2; G12 -2,2; G13 -2,2.8; G14 -2,3.6; G15 -2,4.4; G16 -2,5.2; G17 -2,6; G18 -2,6.8; H1 -1.2,-6.8; H2 -1.2,-6; H3 -1.2,-5.2; H4 -1.2,-4.4; H5 -1.2,-3.6; H6 -1.2,-2.8; H7 -1.2,-2; H8 -1.2,-1.2; H9 -1.2,-0.4; H10 -1.2,0.4; H11 -1.2,1.2; H12 -1.2,2; H13 -1.2,2.8; H14 -1.2,3.6; H15 -1.2,4.4; H16 -1.2,5.2; H17 -1.2,6; H18 -1.2,6.8; J1 -0.4,-6.8; J2 -0.4,-6; J3 -0.4,-5.2; J4 -0.4,-4.4; J5 -0.4,-3.6; J6 -0.4,-2.8; J7 -0.4,-2; J8 -0.4,-1.2; J9 -0.4,-0.4; J10 -0.4,0.4; J11 -0.4,1.2; J12 -0.4,2; J13 -0.4,2.8; J14 -0.4,3.6; J15 -0.4,4.4; J16 -0.4,5.2; J17 -0.4,6; J18 -0.4,6.8; K1 0.4,-6.8; K2 0.4,-6; K3 0.4,-5.2; K4 0.4,-4.4; K5 0.4,-3.6; K6 0.4,-2.8; K7 0.4,-2; K8 0.4,-1.2; K9 0.4,-0.4; K10 0.4,0.4; K11 0.4,1.2; K12 0.4,2; K13 0.4,2.8; K14 0.4,3.6; K15 0.4,4.4; K16 0.4,5.2; K17 0.4,6; K18 0.4,6.8; L1 1.2,-6.8; L2 1.2,-6; L3 1.2,-5.2; L4 1.2,-4.4; L5 1.2,-3.6; L6 1.2,-2.8; L7 1.2,-2; L8 1.2,-1.2; L9 1.2,-0.4; L10 1.2,0.4; L11 1.2,1.2; L12 1.2,2; L13 1.2,2.8; L14 1.2,3.6; L15 1.2,4.4; L16 1.2,5.2; L17 1.2,6; L18 1.2,6.8; M1 2,-6.8; M2 2,-6; M3 2,-5.2; M4 2,-4.4; M5 2,-3.6; M6 2,-2.8; M7 2,-2; M8 2,-1.2; M9 2,-0.4; M10 2,0.4; M11 2,1.2; M12 2,2; M13 2,2.8; M14 2,3.6; M15 2,4.4; M16 2,5.2; M17 2,6; M18 2,6.8; N1 2.8,-6.8; N2 2.8,-6; N3 2.8,-5.2; N4 2.8,-4.4; N5 2.8,-3.6; N6 2.8,-2.8; N7 2.8,-2; N8 2.8,-1.2; N9 2.8,-0.4; N10 2.8,0.4; N11 2.8,1.2; N12 2.8,2; N13 2.8,2.8; N14 2.8,3.6; N15 2.8,4.4; N16 2.8,5.2; N17 2.8,6; N18 2.8,6.8; P1 3.6,-6.8; P2 3.6,-6; P3 3.6,-5.2; P4 3.6,-4.4; P5 3.6,-3.6; P6 3.6,-2.8; P7 3.6,-2; P8 3.6,-1.2; P9 3.6,-0.4; P10 3.6,0.4; P11 3.6,1.2; P12 3.6,2; P13 3.6,2.8; P14 3.6,3.6; P15 3.6,4.4; P16 3.6,5.2; P17 3.6,6; P18 3.6,6.8; R1 4.4,-6.8; R2 4.4,-6; R3 4.4,-5.2; R4 4.4,-4.4; R5 4.4,-3.6; R6 4.4,-2.8; R7 4.4,-2; R8 4.4,-1.2; R9 4.4,-0.4; R10 4.4,0.4; R11 4.4,1.2; R12 4.4,2; R13 4.4,2.8; R14 4.4,3.6; R15 4.4,4.4; R16 4.4,5.2; R17 4.4,6; R18 4.4,6.8; T1 5.2,-6.8; T2 5.2,-6; T3 5.2,-5.2; T4 5.2,-4.4; T5 5.2,-3.6; T6 5.2,-2.8; T7 5.2,-2; T8 5.2,-1.2; T9 5.2,-0.4; T10 5.2,0.4; T11 5.2,1.2; T12 5.2,2; T13 5.2,2.8; T14 5.2,3.6; T15 5.2,4.4; T16 5.2,5.2; T17 5.2,6; T18 5.2,6.8; U1 6,-6.8; U2 6,-6; U3 6,-5.2; U4 6,-4.4; U5 6,-3.6; U6 6,-2.8; U7 6,-2; U8 6,-1.2; U9 6,-0.4; U10 6,0.4; U11 6,1.2; U12 6,2; U13 6,2.8; U14 6,3.6; U15 6,4.4; U16 6,5.2; U17 6,6; U18 6,6.8; V1 6.8,-6.8; V2 6.8,-6; V3 6.8,-5.2; V4 6.8,-4.4; V5 6.8,-3.6; V6 6.8,-2.8; V7 6.8,-2; V8 6.8,-1.2; V9 6.8,-0.4; V10 6.8,0.4; V11 6.8,1.2; V12 6.8,2; V13 6.8,2.8; V14 6.8,3.6; V15 6.8,4.4; V16 6.8,5.2; V17 6.8,6; V18 6.8,6.8
741C083 = smd 0.3 x 0.65: P1 -0.75,-0.575; P2 -0.25,-0.575; P3 0.25,-0.575; P4 0.75,-0.575; P5 -0.75,0.575; P6 -0.25,0.575; P7 0.25,0.575; P8 0.75,0.575
FBGA_96_10_14 = smd 0.4 x 0.4: A1 -3.2,6; A2 -2.4,6; A3 -1.6,6; A7 1.6,6; A8 2.4,6; A9 3.2,6; B1 -3.2,5.2; B2 -2.4,5.2; B3 -1.6,5.2; B7 1.6,5.2; B8 2.4,5.2; B9 3.2,5.2; C1 -3.2,4.4; C2 -2.4,4.4; C3 -1.6,4.4; C7 1.6,4.4; C8 2.4,4.4; C9 3.2,4.4; D1 -3.2,3.6; D2 -2.4,3.6; D3 -1.6,3.6; D7 1.6,3.6; D8 2.4,3.6; D9 3.2,3.6; E1 -3.2,2.8; E2 -2.4,2.8; E3 -1.6,2.8; E7 1.6,2.8; E8 2.4,2.8; E9 3.2,2.8; F1 -3.2,2; F2 -2.4,2; F3 -1.6,2; F7 1.6,2; F8 2.4,2; F9 3.2,2; G1 -3.2,1.2; G2 -2.4,1.2; G3 -1.6,1.2; G7 1.6,1.2; G8 2.4,1.2; G9 3.2,1.2; H1 -3.2,0.4; H2 -2.4,0.4; H3 -1.6,0.4; H7 1.6,0.4; H8 2.4,0.4; H9 3.2,0.4; J1 -3.2,-0.4; J2 -2.4,-0.4; J3 -1.6,-0.4; J7 1.6,-0.4; J8 2.4,-0.4; J9 3.2,-0.4; K1 -3.2,-1.2; K2 -2.4,-1.2; K3 -1.6,-1.2; K7 1.6,-1.2; K8 2.4,-1.2; K9 3.2,-1.2; L1 -3.2,-2; L2 -2.4,-2; L3 -1.6,-2; L7 1.6,-2; L8 2.4,-2; L9 3.2,-2; M1 -3.2,-2.8; M2 -2.4,-2.8; M3 -1.6,-2.8; M7 1.6,-2.8; M8 2.4,-2.8; M9 3.2,-2.8; N1 -3.2,-3.6; N2 -2.4,-3.6; N3 -1.6,-3.6; N7 1.6,-3.6; N8 2.4,-3.6; N9 3.2,-3.6; P1 -3.2,-4.4; P2 -2.4,-4.4; P3 -1.6,-4.4; P7 1.6,-4.4; P8 2.4,-4.4; P9 3.2,-4.4; R1 -3.2,-5.2; R2 -2.4,-5.2; R3 -1.6,-5.2; R7 1.6,-5.2; R8 2.4,-5.2; R9 3.2,-5.2; T1 -3.2,-6; T2 -2.4,-6; T3 -1.6,-6; T7 1.6,-6; T8 2.4,-6; T9 3.2,-6
CM415 = smd 1.1 x 1.9: 1 -1.7,-0.05; 2 1.7,-0.05
CRYSTAL-3225 = smd 1.4 x 1.2: 1 -1.1,-0.85; 2 1.1,-0.85; 3 1.1,0.85; 4 -1.1,0.85

## Placement (x,y rotation side)
ACLK  DNP  [TP0500]  101.2,64.5 90 top
ACS0  DNP  [TP0500]  99.2,64.5 270 top
ARX  DNP  [TP0500]  95.2,64.5 270 top
ATX  DNP  [TP0500]  97.2,64.5 270 top
BOOT0  DNP  [TP0500]  27.65,76 0 bottom
BT4  DNP  [TP0500]  89.7,69 270 top
BTEN  DNP  [TP0500]  89.7,73 270 top
C1  1.0uF  [0402]  96.65,84.75 90 top
C2  0.1uF  [0201]  99.95,84.35 90 bottom
C3  0.1uF  [0201]  95.62,84.45 90 top
C4  10uF  [0402]  93.75,91.3 270 top
C5  10uF  [0402]  92.25,91.3 270 top
C6  0.1uF  [0201]  90.3,91.75 270 top
C7  0.1uF  [0201]  89.75,90.35 90 top
C8  1.0uF  [0402]  91.75,89.7 180 top
C9  0.1uF  [0402]  3.5,85.65 180 bottom
C10  0.1uF  [0201]  79.05,78 270 top
C11  100uF  [PANASONIC_D]  83,76.5 180 top
C12  10uF / 25V  [1206]  85.15,74.6 180 bottom
C13  0.22uF  [0603]  80.15,74.6 0 bottom
C14  22pF  [0402]  79,80.95 270 top
C15  22pF  [0402]  82.9,80.95 270 top
C16  0.1uF  [0201]  66.55,74.45 0 bottom
C17  0.1uF  [0201]  63.55,74.45 180 bottom
C18  0.1uF  [0201]  59.3,75.85 0 top
C19  0.1uF  [0201]  60,74.65 270 bottom
C20  1.0uF  [0201]  58.7,74.65 270 bottom
C21  0.1uF  [0201]  16.05,90.62 180 top
C22  0.1uF  [0201]  16.15,94.95 0 bottom
C23  1.0uF  [0402]  15.75,91.65 180 top
C24  0.1uF  [0201]  58.55,26.15 0 bottom
C25  10uF  [0402]  54.3,27.5 0 bottom
C26  10uF  [0603]  92.8,2.2 90 bottom
C27  0.01uF  [0402]  89.8,4.2 0 bottom
C28  0.1uF  [0402]  89.4,1.8 90 bottom
C29  100uF  [1206]  94.25,9.7 270 bottom
C30  100uF  [1206]  96.55,9.7 270 bottom
C31  100uF  [1206]  89.75,13.25 0 bottom
C32  100uF  [1206]  91.95,9.7 270 bottom
C33  1.0uF  [0402]  6.3,22 0 bottom
C34  0.1uF  [0201]  3.2,22.7 180 bottom
C35  1.0uF  [0402]  1.5,23 0 bottom
C36  0.1uF  [0201]  5.75,23 0 bottom
C37  1.0uF  [0402]  2.5,21.65 180 bottom
C38  0.1uF  [0201]  1,20.95 270 bottom
C39  10uF  [0603]  6.75,19.8 270 bottom
C40  1.0uF  [0402]  0.95,15.05 270 bottom
C41  0.1uF  [0201]  0.85,15.45 270 top
C42  1.0uF  [0402]  5.25,13.85 180 top
C43  0.1uF  [0201]  54.7,28.75 90 bottom
C44  0.1uF  [0201]  55.3,30.8 0 bottom
C45  0.22uF  [0402]  57.05,30.75 0 bottom
C46  4.7uF  [0603]  53.45,29.7 270 bottom
C47  0.47uF  [0402]  53.82,29.07 180 top
C48  0.01uF  [0201]  57.05,26.16 180 bottom
C49  10uF  [0402]  54.25,26.95 270 top
C50  0.1uF  [0201]  55.55,26.15 180 bottom
C51  0.1uF  [0201]  6.6,14.5 180 bottom
C52  0.47uF  [0402]  8,17.6 0 bottom
C53  0.47uF  [0402]  8.75,19 0 bottom
C54  0.47uF  [0402]  8.45,23 0 bottom
C55  0.1uF  [0201]  71.75,76.15 270 bottom
C56  0.1uF  [0201]  73.05,77.75 0 bottom
C57  4.7uF  [0603]  87.45,25.4 270 bottom
C58  0.1uF  [0201]  90.6,25.35 270 bottom
C59  22uF  [0805]  89.15,25.4 270 bottom
C60  10pF  [0402]  99.55,39.95 270 bottom
C61  0.1uF / 16V  [0402]  98.15,36.85 270 bottom
C62  1.0uF  [0603]  98.1,33.6 0 top
C63  10uF / 16V  [0805]  97,34.85 180 bottom
C64  22uF  [0805]  97.15,38.95 180 top
C65  1.0uF  [0402]  6.85,40.1 0 top
C66  DNP  [0402]  5.65,41.25 0 top
C67  0.1uF  [0402]  3.4,41.35 180 top
C68  DNP  [0402]  2.6,29.7 0 top
C69  0.1uF  [0402]  4.8,30.9 0 top
C70  1.0uF  [0402]  101.45,24.35 0 bottom
C71  0.1uF  [0402]  101.45,25.4 0 bottom
C72  1.0uF  [0402]  95.2,22.85 270 top
C73  0.1uF  [0402]  95.2,22.85 270 bottom
C74  0.1uF  [0402]  98.35,29.95 0 top
C75  0.1uF  [0402]  99.75,23.55 90 bottom
C76  0.1uF  [0402]  101.45,23.3 0 bottom
C77  0.1uF  [0402]  101.45,26.45 0 bottom
C78  0.1uF  [0402]  100.4,29.95 0 top
C79  0.1uF  [0402]  95.6,30 90 top
C80  0.1uF  [0402]  96.85,22.35 180 bottom
C81  1.0uF  [0402]  101.45,27.5 0 bottom
C82  4.7uF  [0603]  102.1,28.85 0 bottom
C83  22pF  [0402]  97.05,25.8 180 bottom
C84  22pF  [0402]  97.05,24.65 180 bottom
C85  0.1uF  [0402]  98.6,23.55 90 bottom
C86  10uF/50V  [1206]  91,46.05 0 bottom
C87  10nF  [0603]  87.1,45.25 270 bottom
C88  0.01uF  [0402]  94.45,41.4 90 bottom
C89  0.01uF  [0402]  85.95,38.15 270 top
C90  330uF  [PANASONIC_F]  90.95,41.15 180 top
C91  0.1uF  [0402]  17.45,67.5 270 bottom
C92  10uF  [0603]  15.45,67.75 270 bottom
C93  0.1uF  [0201]  8.1,63.25 0 bottom
C94  0.1uF  [0201]  5.55,63.2 180 bottom
C95  1.0uF  [0402]  6.35,63.15 0 top
C96  0.1uF  [0201]  95.62,86.95 90 top
C97  0.1uF  [0201]  99.95,86.85 90 bottom
C98  1.0uF  [0402]  96.65,87.25 90 top
C99  10uF  [0402]  39.25,91.3 270 top
C100  10uF  [0402]  37.75,91.3 270 top
C101  0.1uF  [0201]  35.8,91.75 270 top
C102  0.1uF  [0201]  35.25,90.35 90 top
C103  1.0uF  [0402]  37.25,89.7 180 top
C104  0.1uF  [0402]  11.5,85.65 180 bottom
C106  0.1uF  [0201]  42.05,78 270 top
C107  100uF  [PANASONIC_D]  46,76.5 180 top
C108  10uF / 25V  [1206]  48.15,74.6 180 bottom
C109  0.22uF  [0603]  43.15,74.6 0 bottom
C110  22pF  [0402]  42,80.95 270 top
C111  22pF  [0402]  45.9,80.95 270 top
C112  0.1uF  [0201]  13.55,90.62 180 top
C113  0.1uF  [0201]  13.65,94.95 0 bottom
C114  1.0uF  [0402]  13.25,91.65 180 top
C115  0.1uF  [0402]  95.85,71.2 180 bottom
C116  10uF  [0603]  93.8,69.65 90 bottom
C117  10uF  [0603]  101,68 180 bottom
C118  0.1uF  [0201]  61.18,87.64 90 bottom
C119  0.1uF  [0201]  60.21,87.63 90 top
C120  4.7uF  [0603]  5.28,4.45 180 bottom
C121  22pF  [0402]  31.65,66.6 270 top
C122  22pF  [0402]  30.4,68.7 270 top
C123  0.1uF  [0201]  29,71 180 bottom
C124  4.7uF  [0603]  24.85,67.25 270 bottom
C125  0.1uF  [0201]  39,81 0 bottom
C126  0.1uF  [0201]  39,86 0 bottom
C127  0.1uF  [0201]  25.5,87 180 bottom
C128  0.1uF  [0201]  23.1,77.5 270 bottom
C129  0.1uF  [0201]  23.05,66.7 180 top
C130  0.1uF  [0201]  39.1,70.55 180 top
C131  1.0uF  [0402]  35.25,69.05 180 top
C132  0.01uF  [0201]  34.5,68 180 top
C133  1.0uF  [0402]  35.65,66.1 180 top
C134  0.01uF  [0201]  35.95,67.1 180 top
C135  2.2uF  [0603]  39,83.5 270 bottom
C136  2.2uF  [0603]  23.15,85 270 bottom
C137  4.7uF  [0603]  23,70.7 90 top
C138  0.1uF  [0201]  23,68.15 180 top
C139  0.1uF  [0201]  59.3,79.85 0 top
C140  0.1uF  [0201]  60,78.65 270 bottom
C141  1.0uF  [0201]  58.7,78.65 270 bottom
C142  0.1uF  [0402]  91.7,71.5 90 bottom
C143  10pF  [0402]  91.7,66.75 270 bottom
C144  0.1uF  [0201]  35.2,45.05 180 bottom
C145  0.1uF  [0201]  28.85,48.85 270 bottom
C146  0.1uF  [0201]  21.8,48.2 270 bottom
C147  0.1uF  [0201]  20.15,47.9 0 bottom
C148  0.1uF  [0201]  26.2,48.75 180 bottom
C149  0.1uF  [0201]  36.45,56.4 90 bottom
C150  0.1uF  [0201]  25.95,58.5 90 top
C151  0.1uF  [0201]  18.45,56.8 90 bottom
C152  0.1uF  [0201]  19.95,58.05 0 bottom
C153  0.1uF  [0402]  71.9,12.55 270 top
C154  0.1uF  [0402]  77.6,14.5 0 bottom
C155  0.1uF  [0402]  68.55,25.45 90 top
C156  0.1uF  [0402]  83.05,15.5 270 top
C157  0.1uF  [0402]  65.8,17.85 270 top
C158  10uF  [0603]  82.95,8.15 270 top
C159  10uF  [0603]  70.75,13.9 90 top
C160  10uF  [0603]  81,10.45 0 top
C161  0.1uF  [0402]  67.4,21.25 0 bottom
C162  0.1uF  [0402]  70,6 270 top
C163  0.1uF  [0402]  74.6,14.5 0 bottom
C164  1.0uF  [0201]  65.6,58.85 0 bottom
C165  1.0uF  [0201]  65.95,54 0 bottom
C166  1.0uF  [0201]  65.6,58 0 bottom
C167  1.0uF  [0201]  65.6,59.8 0 bottom
C168  12pF  [0201]  80.5,58.35 90 top
C169  12pF  [0201]  82.5,61.35 0 top
C170  12pF  [0201]  64.2,55.1 270 top
C171  12pF  [0201]  64.2,53.7 90 top
C172  0.01uF  [0201]  75.9,54.35 0 bottom
C173  0.01uF  [0201]  72.6,61.73 270 bottom
C174  0.1uF  [0402]  91.7,76.25 90 bottom
C175  10pF  [0402]  91.7,73.75 270 bottom
C176  0.01uF  [0201]  74.05,60.75 180 bottom
C177  0.01uF  [0201]  67.97,57.3 180 bottom
C178  0.01uF  [0201]  75.95,60.7 0 bottom
C179  0.01uF  [0201]  75.9,53.5 0 bottom
C180  0.01uF  [0201]  76.75,59 270 bottom
C181  0.01uF  [0201]  69.12,56.95 90 bottom
C182  0.01uF  [0201]  72.35,59.77 0 bottom
C183  0.01uF  [0201]  76.75,57.6 90 bottom
C184  0.01uF  [0201]  74.89,58.25 90 bottom
C185  0.01uF  [0201]  74.6,63.8 0 bottom
C186  0.01uF  [0201]  74.9,56.6 90 bottom
C187  0.01uF  [0201]  73.76,58.21 180 bottom
C188  0.01uF  [0201]  68.55,59.3 270 bottom
C189  0.01uF  [0201]  69.95,56.95 90 bottom
C190  0.01uF  [0201]  68.42,58.17 180 bottom
C191  0.01uF  [0201]  72.35,60.6 0 bottom
C192  0.01uF  [0201]  69.95,61.65 180 bottom
C193  0.01uF  [0201]  76.4,61.55 0 bottom
C194  0.01uF  [0201]  71.2,60.5 270 bottom
C195  0.01uF  [0201]  72,63.9 0 bottom
C196  0.01uF  [0201]  75,62.45 0 bottom
C197  10uF  [0603]  82.5,64.8 180 bottom
C198  10uF  [0603]  71.8,57 90 bottom
C199  10uF  [0603]  71.45,64.95 0 bottom
C200  10uF  [0603]  71.45,66.3 0 bottom
C201  10uF  [0603]  78.3,65.7 90 bottom
C202  10uF  [0603]  82.5,66.25 180 bottom
C203  10uF  [0603]  82.5,67.75 180 bottom
C204  10uF  [0603]  74.6,65.75 90 bottom
C205  0.01uF  [0201]  70.78,56.95 90 bottom
C206  0.01uF  [0201]  74.75,61.6 180 bottom
C207  0.01uF  [0201]  73.5,53.35 0 bottom
C208  0.01uF  [0201]  70.05,53.3 180 bottom
C209  0.01uF  [0201]  71.7,55.05 180 bottom
C210  0.01uF  [0201]  71.7,54.15 180 bottom
C211  0.01uF  [0201]  71.7,53.3 180 bottom
C212  0.01uF  [0201]  74.75,53.8 90 bottom
C213  0.01uF  [0201]  75.9,59 270 bottom
C214  0.01uF  [0201]  73.6,57.3 0 bottom
C215  0.01uF  [0201]  75.75,56.75 90 bottom
C216  0.01uF  [0201]  70.05,55.77 180 bottom
C217  0.01uF  [0201]  78.25,63.75 180 bottom
C218  0.01uF  [0201]  75.9,55.2 0 bottom
C219  0.01uF  [0201]  59,51.95 0 top
C220  0.1uF  [0201]  59.25,66 0 bottom
C221  4.7uF  [0603]  54.9,42.5 270 top
C222  22uF  [0805]  51.35,48.45 270 bottom
C223  0.1uF  [0201]  50.15,50.15 270 top
C224  10uF  [0603]  51.3,47.4 0 top
C225  4.7uF  [0603]  55.4,48.15 0 top
C226  10uF  [0603]  54.07,60.25 90 bottom
C227  10uF  [0603]  52.56,60.26 90 bottom
C228  10uF  [0603]  57.75,53.7 180 bottom
C229  10uF  [0603]  57.75,55.2 180 bottom
C230  10uF  [0603]  54.1,62.4 0 bottom
C231  10uF  [0603]  58.9,60.2 180 bottom
C232  10uF  [0603]  48.3,55.85 90 top
C233  10uF  [0603]  48.2,52.15 270 top
C234  4.7uF_50V  [1210]  49,60.4 90 bottom
C235  4.7uF  [0603]  53.1,48.3 270 bottom
C236  2.2uF  [0402]  50.6,48.9 180 top
C237  2.2uF  [0402]  59.15,50.95 0 top
C238  0.01uF  [0201]  70.05,54.95 180 bottom
C239  0.01uF  [0201]  73.75,59.05 0 bottom
C240  0.01uF  [0201]  74.1,59.9 180 bottom
C241  0.01uF  [0201]  71.8,58.95 180 bottom
C242  0.01uF  [0201]  73.5,55.9 0 bottom
C243  0.01uF  [0201]  73.5,54.2 0 bottom
C244  0.01uF  [0201]  70.05,54.12 180 bottom
C245  0.01uF  [0201]  73.5,55.05 0 bottom
C246  0.01uF  [0201]  58.35,58.7 180 bottom
C247  0.01uF  [0201]  70.15,58.08 180 bottom
C248  0.01uF  [0201]  70,60.67 180 bottom
C249  0.01uF  [0201]  70,59.8 180 bottom
C250  0.01uF  [0201]  70,58.95 180 bottom
C251  0.01uF  [0201]  65.1,55.5 0 bottom
C252  0.1uF  [0201]  68.57,35 180 bottom
C253  0.1uF  [0201]  68.91,44.73 90 bottom
C254  0.1uF  [0201]  62.23,35 0 bottom
C255  0.1uF  [0201]  64.1,44.74 90 bottom
C256  0.1uF  [0201]  67.7,39.73 270 bottom
C257  0.1uF  [0201]  65.3,39.73 90 bottom
C258  0.1uF  [0201]  74.24,35 0 bottom
C259  0.1uF  [0201]  62.51,44.74 270 bottom
C260  0.1uF  [0201]  74.51,44.75 90 bottom
C261  0.1uF  [0201]  70.51,44.73 90 bottom
C262  0.1uF  [0201]  71.55,35 180 bottom
CONN1  U.FL  [U.FL]  92.8,81.4 0 top
D1  RED  [D0603]  103.5,59 270 top
D2  GREEN  [D0603]  97,97 90 top
D3  PS04LTVA1  [D0402]  95.3,17.25 180 bottom
D4  PS04LTVA1  [D0402]  96.65,17.25 180 bottom
D5  B72590D50A060  [D0402]  99.5,10 180 bottom
D6  B72590D50A060  [D0402]  92.05,5.4 270 bottom
D7  PS04LTVA1  [D0402]  93.75,17.25 180 bottom
D8  PS04LTVA1  [D0402]  98.35,17.25 180 bottom
D9  B72590D50A060  [D0402]  99.25,6.2 0 bottom
D10  CDBC540-G  [DO-214AB]  90.95,50.15 0 bottom
D11  BLUE  [D0603]  97,91.5 90 top
D12  YELLOW  [D0603]  102.5,97 90 top
D13  PS04LTVA1  [D0402]  5.97,98.1 180 bottom
D14  PS04LTVA1  [D0402]  5.17,98.1 180 bottom
D16  B72590D50A060  [D0402]  3.88,98.1 180 bottom
D17  PS04LTVA1  [D0402]  4.53,1.9 0 bottom
D18  PS04LTVA1  [D0402]  5.33,1.9 0 bottom
D19  B72590D50A060  [D0402]  3.23,1.9 0 bottom
D20  B72590D50A060  [D0402]  6.62,1.9 0 bottom
D21  PS04LTVA1  [D0402]  80.8,12.35 270 bottom
D22  PS04LTVA1  [D0402]  80.8,10.45 270 bottom
D23  PS04LTVA1  [D0402]  80,4.5 270 bottom
D24  PS04LTVA1  [D0402]  80,3.2 270 bottom
D25  PS04LTVA1  [D0402]  72.5,8.7 90 bottom
D26  PS04LTVA1  [D0402]  72.5,10 90 bottom
D27  PS04LTVA1  [D0402]  72,3 90 bottom
D28  PS04LTVA1  [D0402]  72,4.25 90 bottom
D29  PS04LTVA1  [D0402]  67.95,10.5 270 top
D30  PS04LTVA1  [D0402]  68.5,8.75 270 top
D31  MBRA140T3G  [SMAJ]  48.9,61.7 90 top
F1  MF-FSMF020X-2  [0603]  93.55,90.8 270 bottom
F2  MF-FSMF020X-2  [0603]  89.95,90.8 270 bottom
F3  2920L500/16MR  [2920]  95,59 0 top
F4  MF-FSMF020X-2  [0603]  39.05,90.8 270 bottom
F5  MF-FSMF020X-2  [0603]  35.45,90.8 270 bottom
FB1  120R 1A  [0402]  89.8,5.4 180 bottom
FB2  120R 1A  [0402]  91,1.35 180 bottom
FB3  120R 1A  [0402]  89.5,7.5 270 bottom
FB4  120R 1A  [0402]  98.25,9.9 270 bottom
FB5  120R 1A  [0402]  91.7,69.25 90 bottom
FB6  120R 1A  [0402]  95.7,66.35 0 bottom
FB7  120R 1A  [0402]  80.5,9 180 top
FB8  120R 1A  [0402]  70.75,11.25 90 top
FB9  120R 1A  [0402]  38.71,67.55 90 top
FB10  120R 6.0A  [0805]  54.7,45.8 90 top
FB11  120R 1A  [0402]  63.9,57.75 180 top
FB12  120R 1A  [0402]  63.35,59.95 270 bottom
GND  DNP  [P1-13]  103.45,52.5 270 top
IC1  EP5368  [EP-3X3MMQFN16]  88.85,25.4 90 top
IC2  TPS62111  [PQFP16]  101.25,36.35 90 bottom
IC3  STM32F10XVXT6-FLASH  [TQFP100]  31,79 90 top
IC4  TFP410  [TQFP-64]  75.8,20.35 0 top
J1  MA03X1 FEMALE  [MA03-100]  101.2,84.75 180 top
J2  MA03X2 FEMALE  [MA03-2]  91.75,96.2 0 top
J3  ML-621S/ZTN  [BATTERY_6.8MM-2998]  5,49.05 90 bottom
J4  0.1 FEMALE  [1X06]  25.68,91.16 180 top
J5  0.1 FEMALE  [2X06]  25.68,97.51 0 top
J6  DNP  [MA03-100]  15.75,96.2 270 top
J7  DNP  [2X03]  2.5,60.25 90 top
J8  DNP  [MA03-100]  101.2,87.25 180 top
J9  MA03X2 FEMALE  [MA03-2]  37.25,96.2 0 top
J10  USB_MICRO_B  [USB_MICRO_B]  5.25,100 180 top
J11  MA03X1 FEMALE  [MA03-100]  13.25,96.2 270 top
J12  CONN20FEMALE  [057-020-1]  64.5,97.5 180 top
J13  CONN10FEMALE  [057-010-1]  64.5,91.15 180 top
J14  USB_MICRO_B  [USB_MICRO_B]  5.25,0 0 top
J15  HDMIMICRO  [46765-001]  75.68,0.08 0 top
JTAG  DNP  [1365-10]  31.2,79.85 270 bottom
K1  61400826021  [61400826021]  96,10.1 0 top
L1  6.8uH  [1515]  101.35,38.15 180 top
L2  10uH  [3232DZ]  90.95,50.15 180 top
L3  DLP11SN900HL2  [0504-DLP11S]  95.95,18.55 90 top
L4  DLP11SN900HL2  [0504-DLP11S]  99,19.75 90 top
L5  DLP11SN900HL2  [0504-DLP11S]  5.55,94 270 top
L6  DLP11SN900HL2  [0504-DLP11S]  7.25,5.75 0 top
L7  DLP0NSN900HL2  [03025-DLP0NS]  78.8,12.35 270 top
L8  DLP0NSN900HL2  [03025-DLP0NS]  77.3,12.35 270 top
L9  DLP0NSN900HL2  [03025-DLP0NS]  75.8,12.35 270 top
L10  DLP0NSN900HL2  [03025-DLP0NS]  74.3,12.35 270 top
L11  2.2uH  [1515]  59.25,54.5 270 top
L12  2.2uH  [1515]  58.25,61 180 top
L13  2.2uH  [1515]  53.5,61 0 top
L14  18uH  [WE-PD2_4532]  49.5,66 0 bottom
Q1  FDT434P  [SOT223]  93.5,59 270 bottom
Q2  BSS138  [SOT23]  97,97 0 bottom
Q3  BSS138  [SOT23]  97,91.5 0 bottom
Q4  BSS138  [SOT23]  102.5,97 0 bottom
Q5  32.768kHz  [ASF]  95,74.5 90 bottom
Q6  FDT434P  [SOT223]  99.9,46.65 180 bottom
R1  15K  [0402]  3.5,83.35 180 bottom
R2  DNP  [0402]  3.5,84.5 0 bottom
R3  10K  [0201]  7.5,47.05 270 top
R4  5K6 1P  [0402]  79,83 270 top
R5  5K6 1P  [0402]  81.5,85.65 180 top
R6  2K32 1P  [0402]  81.3,82.4 0 top
R7  2K32 1P  [0402]  81.3,84.15 0 top
R8  470R  [0402]  83.1,85.3 90 top
R9  470R  [0402]  81.3,80.55 0 top
R10  1K5  [0402]  82.4,86.85 0 top
R11  5K6 1P  [0402]  82.9,82.95 270 top
R12  5K6 1P  [0402]  85.4,85.65 180 top
R13  2K32 1P  [0402]  85.2,82.4 0 top
R14  2K32 1P  [0402]  85.2,84.15 0 top
R15  470R  [0402]  87,85.25 90 top
R16  470R  [0402]  85.2,80.55 0 top
R17  1K5  [0402]  86.3,86.85 0 top
R18  330R  [0201]  103.5,60.95 0 top
R19  30K  [0201]  98.25,60.25 90 bottom
R20  1K  [0201]  98.25,57.75 270 bottom
R21  DNP  [0201]  56.4,74.9 90 bottom
R22  DNP  [0201]  57.75,74.9 90 bottom
R23  150R  [0402]  95.75,96.7 270 top
R24  10K  [0402]  95.65,98 270 bottom
R25  1K  [0402]  98.25,98 270 bottom
R26  100K  [0201]  7.6,14 270 top
R27  DNP  [0201]  6.75,14 90 top
R28  DNP  [0201]  9.65,14 90 top
R29  100K  [0201]  8.7,14 270 top
R30  100K  [0201]  5.4,15.45 270 bottom
R31  100K  [0201]  1,19.05 270 bottom
R32  1K5  [0201]  8.5,23.3 180 top
R33  10K  [0201]  53.35,30.4 270 top
R34  0R  [0201]  9.75,22.1 270 top
R35  0R  [0201]  2.5,15.45 90 bottom
R36  DNP  [0201]  71.6,77.75 0 top
R37  DNP  [0201]  72.7,76.35 270 bottom
R38  1M0  [0402]  101.95,39.95 90 bottom
R39  0R  [0402]  100.75,39.95 90 bottom
R40  DNP  [0402]  98.15,38.95 90 bottom
R41  15K  [0201]  3.15,40 0 top
R42  0R  [0201]  5,40.05 180 top
R43  22K  [0402]  2.6,30.9 180 top
R44  DNP  [0402]  96.75,29.65 270 top
R45  100K  [0402]  98.35,31.1 0 top
R46  12K0  [0402]  97,23.5 0 bottom
R47  100K  [0402]  98.7,27.4 90 bottom
R48  100K  [0402]  97.55,27.4 90 bottom
R49  100K  [0402]  96.4,27.4 90 bottom
R50  100K  [0402]  99.85,27.4 90 bottom
R51  1M0  [0402]  95.2,25.25 270 top
R52  0R  [0805]  95.35,45.05 90 bottom
R53  100K  [0402]  87.45,39.3 270 bottom
R54  31K6  [0402]  86.2,39.3 90 bottom
R55  180R  [0402]  95.75,91.2 270 top
R56  10K  [0402]  95.65,92.5 270 bottom
R57  1K  [0402]  98.25,92.5 270 bottom
R58  180R  [0402]  101.25,96.7 270 top
R59  10K  [0402]  101.15,98 270 bottom
R60  1K  [0402]  103.75,98 270 bottom
R61  15K  [0402]  11.5,83.35 180 bottom
R62  18K  [0402]  11.5,84.5 0 bottom
R63  DNP  [0603]  17.95,85.95 0 bottom
R64  5K6 1P  [0402]  42,83 270 top
R65  5K6 1P  [0402]  44.5,85.65 180 top
R66  2K32 1P  [0402]  44.3,82.4 0 top
R67  2K32 1P  [0402]  44.3,84.15 0 top
R68  470R  [0402]  46.1,85.3 90 top
R69  470R  [0402]  44.3,80.55 0 top
R70  1K5  [0402]  45.4,86.85 0 top
R71  5K6 1P  [0402]  45.9,82.95 270 top
R72  5K6 1P  [0402]  48.4,85.65 180 top
R73  2K32 1P  [0402]  48.2,82.4 0 top
R74  2K32 1P  [0402]  48.2,84.15 0 top
R75  470R  [0402]  50,85.25 90 top
R76  470R  [0402]  48.2,80.55 0 top
R77  1K5  [0402]  49.3,86.85 0 top
R78  0R  [0201]  60.45,86.41 180 top
R79  0R  [0201]  58.96,86.41 0 top
R80  DNP  [0201]  55.32,87.3 90 top
R81  DNP  [0201]  53.74,87.31 90 top
R82  0R  [0402]  3.2,5.55 0 top
R83  240R0  [0201]  31.5,69 270 top
R84  33R0  [0201]  35.95,68.01 0 top
R85  100K  [0402]  23.25,75.55 270 bottom
R86  10K  [0201]  33.7,75.4 180 bottom
R87  0R  [0201]  34.15,66.65 90 top
R88  100K  [0201]  32,69 90 bottom
R89  10K  [0201]  33.65,69.25 180 bottom
R90  0R  [0201]  26.6,74.55 90 bottom
R91  10K  [0201]  31.2,73.5 0 bottom
R92  100K  [0201]  29.25,83.55 0 bottom
R93  DNP  [0201]  56.4,78.9 90 bottom
R94  DNP  [0201]  57.75,78.9 90 bottom
R95  75K  [0402]  22.7,46.1 180 bottom
R96  10K  [0402]  66.25,21.45 0 top
R97  10K  [0402]  67.65,17.95 0 top
R98  10K  [0402]  67.65,15.8 0 top
R99  10K  [0402]  69.65,23.1 180 bottom
R100  10K  [0402]  66.4,24.8 180 top
R101  10K  [0402]  67.65,16.9 0 top
R102  510R  [0402]  73.05,12.55 270 top
R103  10K  [0402]  66.25,20.4 0 top
R104  4K7  [0402]  66.25,19.35 0 top
R105  10K  [0402]  84.25,15.45 90 top
R106  200K  [0402]  68.4,12.8 90 bottom
R107  1K5  [0402]  69.1,21.65 270 bottom
R108  1K5  [0402]  70.15,21.65 270 bottom
R109  1K5  [0402]  69.5,9.3 180 bottom
R110  DNP  [0603]  89.2,20.45 0 bottom
R111  DNP  [0603]  17.95,84.4 0 bottom
R112  1K5  [0402]  68.85,10.5 180 bottom
R113  10R0  [0402]  71.45,27.5 0 top
R114  DNP  [0402]  84.25,12.8 270 top
R115  10R0  [0402]  66.94,25.9 0 top
R116  10R0  [0402]  66.25,22.6 0 top
R117  10R0  [0402]  66.4,23.7 0 top
R118  0R  [0201]  64.25,52.1 90 top
R119  0R  [0201]  66.6,65.75 270 top
R120  180K  [0201]  51.5,55.8 90 bottom
R121  100K  [0201]  51.35,58 180 top
R122  1K5  [0201]  59.2,64 0 bottom
R123  1K5  [0201]  57.75,64.65 0 bottom
R124  100K  [0201]  57.65,51.65 90 top
R125  10K  [0201]  57.55,51.95 180 bottom
R126  10K  [0201]  65,60.7 0 bottom
R127  10K  [0201]  65,61.6 0 bottom
R128  1K5  [0201]  68.15,67.15 270 top
R129  49R9  [0201]  71.8,51.2 90 bottom
R130  1K5  [0201]  68.15,65.7 90 top
R131  10K  [0201]  68.92,39.72 90 bottom
R132  10K  [0201]  66.5,39.73 90 bottom
R133  240R0  [0201]  65.03,35 0 bottom
R134  1K5  [0201]  62.51,39.72 90 bottom
R135  10K  [0201]  66.76,35.01 0 bottom
R136  DNP  [0603]  17.95,81.3 0 bottom
R137  DNP  [0603]  17.95,82.85 0 bottom
R138  1K5  [0201]  93.6,86.85 0 bottom
R139  1K5  [0201]  93.6,87.8 0 bottom
R340  100K  [0201]  54.5,66.4 0 bottom
R342  100K  [0201]  54.5,65.35 0 bottom
R344  100K  [0201]  54.45,64.5 0 bottom
RP1  33R0  [741X16]  18.3,76 180 top
RP2  10K0  [741X16]  18.5,70 90 bottom
RP3  DNP  [741X08]  65.05,76.7 270 bottom
RP4  DNP  [741X16]  7,59.5 0 top
RP5  10K0  [741X16]  99.3,70 270 bottom
RP6  33R0  [741X16]  99.3,75 270 bottom
RP7  DNP  [741X16]  67.95,87.14 90 top
RP8  10R0  [741X16]  74.8,28.87 90 top
RP9  10R0  [741X16]  79.3,28.85 90 top
RP10  10R0  [741X16]  83.5,19.85 0 top
S1  EVQ  [EVQ]  3.25,84.75 270 top
S2  EVQ  [EVQ]  11.25,84.75 270 top
SPKR+  DNP  [P1-13]  7.5,27.5 0 top
SPKR-  DNP  [P1-13]  2.5,27.5 0 top
TP1  DNP  [TP0500]  98,44 0 top
U1  TXS0102  [DFN8-0.4P]  96.08,84.75 90 bottom
U2  TXS0102  [DFN8-0.4P]  91.75,91.35 0 bottom
U3  DS1340  [SO-8]  4,48 270 top
U4  [SSOP24]  83,81 180 bottom
U5  0.100 MALE PIN  [2X03_SHROUD]  83,95.5 180 top
U6  APTB1615  [APTB1615]  79.5,88.65 0 top
U7  APTB1615  [APTB1615]  86.5,88.65 180 top
U8  TXS0108E  [QFN20]  65.05,76.55 90 top
U9  JS102011SAQN  [JS102011SAQN]  102.8,59 270 bottom
U10  TXS0102  [DFN8-0.4P]  57.1,75 0 top
U11  TXS0102  [DFN8-0.4P]  15.75,91.08 0 bottom
U12  L3G4200D  [LGA16-4X4MM]  57,28.5 90 top
U13  LSM303D  [LGA16-3X3MM]  57.05,28.5 270 bottom
U14  TPS2052B  [MSOP8-PAD]  97.85,1.65 90 bottom
U15  TLV320AIC3106  [QFN48]  5.25,18.85 180 top
U16  [UQFN-10]  72.6,76.15 0 top
U17  LM4862M  [SO-8]  5,35.5 270 top
U18  USB2513  [QFN36-6X6MM]  99.75,25.45 90 top
U19  OR_GATE_3  [SOT-23-6]  100.5,20.8 270 bottom
U20  TXS0108E  [QFN20]  7,60 270 bottom
U21  TXS0102  [DFN8-0.4P]  96.08,87.25 90 bottom
U22  TXS0102  [DFN8-0.4P]  37.25,91.35 0 bottom
U23  [SSOP24]  46,81 180 bottom
U24  0.100 MALE PIN  [2X03_SHROUD]  46,95.5 180 top
U25  APTB1615  [APTB1615]  42.5,88.65 0 top
U26  APTB1615  [APTB1615]  49.5,88.65 180 top
U27  TXS0102  [DFN8-0.4P]  13.25,91.08 0 bottom
U28  WL1831MOD  [WL1801MOD]  97.7,72.25 90 top
U29  TXS0108E  [QFN20]  67.95,87.15 0 bottom
U30  TXS0102  [DFN8-0.4P]  54.53,87.31 0 bottom
U31  [KMT0]  31.2,75.3 0 bottom
U32  TXS0102  [DFN8-0.4P]  57.1,79 0 top
U33  PCA9306  [DCT-8(SSOP)]  69,17.5 270 bottom
U34  AT24C01B-TH_B  [TSSOP8]  56.25,65 270 top
U35  TPS65217D  [QFN40P600X600X100-49]  53.15,54 90 top
U$27  TPS5450  [8SO_POWERPAD]  90.95,40.95 90 bottom
U$30  [USD]  15.95,80.7 90 top
U$66  ADS7846RGV  [QFN16]  31.95,47.8 0 bottom
U$67  SN74LVC16T245  [TVSOP48]  34.25,53.52 180 top
U$68  SN74LVC16T245  [TVSOP48]  23.75,53.52 180 top
U$69  SN74LVC16T245  [TVSOP48]  23.75,53.52 180 bottom
U$70  FH12-40-NHD-4.3  [FH12-40S-0.5SH]  28.7,43.6 0 top
U$72  AM3354BZCZ80  [BGA324C80P18X18]  72.55,57.5 0 top
U$79  100K  [741C083]  81.75,41 0 top
U$80  100K  [741C083]  79.5,41 0 top
U$81  100K  [741C083]  82.65,49.75 90 top
U$82  100K  [741C083]  82.65,51.95 90 top
U$101  MT41K256M16  [FBGA_96_10_14]  68.11,39.73 270 top
VCC  DNP  [P1-13]  99.9,52.5 270 top
VCC1  DNP  [TP0500]  27.65,73.5 90 bottom
WLDB  DNP  [TP0500]  89.7,71 270 top
WLEN  DNP  [TP0500]  89.7,75 90 top
WLRX  DNP  [TP0500]  98.2,80 90 bottom
WLTX  DNP  [TP0500]  96.2,80 90 bottom
X1  32.768  [CM415]  6,53.5 0 top
X2  12MHz 1.8V  [ASF]  3.85,18.5 270 bottom
Y1  24.000MHz  [CRYSTAL-3225]  93.9,26.05 270 bottom
Y2  24.000MHz  [CRYSTAL-3225]  27.5,67.6 90 top
Y3  24.000MHz  [CRYSTAL-3225]  82.65,58.85 90 top
Y4  32.768kHz  [1206]  62.6,53.2 90 top

## Tracks (layer width: path | path; a pad name or v marks a point on that pad's centre or on a via)
3V_DISPLAY_EN$43  (via drill 0.2 pad 0.46)
  Top 0.102: U$67.38 34.85,49.65 34.7,49.5 34.7,49.05 34.85,48.9 34.85,48.83
  Top 0.152: U$67.38 v34.85,52.4 | 34.85,48.83 33.95,47.92 U$70.31
3V_L_BIAS$43
  Top 0.152: U$67.43 36.85,49.33 35.45,47.92 U$70.34
3V_L_FCLK$43
  Top 0.152: U$67.41 36.05,49.02 34.95,47.92 U$70.33
3V_L_LCLK$43
  Top 0.152: U$67.40 35.65,49.12 34.45,47.92 U$70.32
3V_L_PCLK$43
  Top 0.152: U$67.37 34.45,48.92 33.45,47.92 U$70.30
3V_MISO$43
  Bottom 0.152: U$69.41 21.95,51.66 23.09,52.8 31.76,52.8 32.92,51.64 U$66.16
3V_MOSI$43  (via drill 0.2 pad 0.46)
  Top 0.152: v37.25,48.8 U$67.44
  Bottom 0.152: U$66.2 36.58,48.12 v37.25,48.8
3V_NPENIRQ$43
  Bottom 0.152: R95.2 U$69.38 23.15,51.41 24.04,52.3 30.76,52.3 32.25,50.81 32.25,49.7 U$66.15
3V_SPI_CLK$43  (via drill 0.2 pad 0.46)
  Top 0.152: v38.45,49.3 U$67.47
  Bottom 0.152: U$66.4 36.72,46.83 38.45,48.55 v38.45,49.3
4.VCC_BATT  (via drill 0.2)
  Top 0.813: v96.5,63 v97,63 v97.5,63 98.3,62.2 F3.2
  Top 2.184: VCC.TP 98.3,54.1 F3.2
  S3 0.254: v88.7,70.6 88.7,66.2 88.75,66.15 88.85,66.15 v88.85,62.1
  S14 0.254: v41.4,70.75 41.4,71.15 51.7,71.15 51.75,71.1 51.75,70.6 v88.7,70.6 | v88.85,62.1 88.85,62.25 91.7,62.25 91.75,62.3 91.75,63 v96.5,63
  Bottom 0.254: v41.4,70.75 41.15,70.75 40.65,70.25 40.6,70.25 36.4,66.05 33.05,66.05 v33,66
  Bottom 0.305: R19.2 98.25,62.25 v97.5,63 | R88.1 32.27,68.73 32.7,68.3 32.7,66.3 v33,66
  Bottom 1.27: Q6.3 102.21,50.69 100.4,52.5 VCC.TP
5V_1$2
  pour Bottom: 94.2,97.6 94.2,91.15 92,91.15 92,97.6
5V_1$28
  pour Bottom: 39.7,97.6 39.7,91.15 37.5,91.15 37.5,97.6
5V_2$2
  pour Bottom: 89.3,97.6 91.6,97.6 91.6,91.15 89.3,91.15
5V_2$28
  pour Bottom: 34.8,97.6 37.1,97.6 37.1,91.15 34.8,91.15
5V_SCL$44  (via drill 0.2 pad 0.46)
  Top 0.152: J15.17 74.25,7.25 74.25,7.78 73.68,8.35 71.55,8.35 70.8,9.1 v69.4,10.5
  Top 0.254: D29.P2 v69.4,10.5
  Bottom 0.152: v69.4,10.5 R112.2 U33.6
5V_SDA$44  (via drill 0.2 pad 0.46)
  Top 0.152: J15.18 74.1,5.96 74.1,5.6 74,5.5 74,5.08 73.82,4.9 73.7,4.9 v73.55,4.75 | v72.55,7.8 70.92,7.8 v69.95,8.77
  Top 0.254: D30.P2 69.95,8.75 v69.95,8.77
  Bottom 0.152: v72.55,7.8 73.99,6.36 73.99,5.19 v73.55,4.75 | v69.95,8.77 R109.2 U33.5
9.VCC_BATT_NOFUSE  (via drill 0.2, 0.2 pad 0.25)
  Top 0.61: v96.75,42.85 96.85,42.85 TP1.1
  Bottom 0.254: C61.1 99.25,37.3 IC2.8 | IC2.2 IC2.3 IC2.4
  Bottom 0.406: C63.1 96.15,33.85 v95.95,33.65
  Bottom 0.61: R52.1 95.35,43.7 95.35,43.45 95.95,42.85 v96.75,42.85
  Bottom 1.27: Q6.2 Q6.4 | 96.6,43.55 96.6,36.8 96.15,36.35 C63.1
  Bottom 1.778: Q6.4 96.6,43.55 95.5,43.55 95.35,43.7
  other vias: 96.45,33.65 96.45,33.15 95.95,33.15
  pour Top: 95.65,34.1 97.85,34.1 97.85,33.05 95.65,33.05
  pour Bottom: 99.75,37.55 99.75,37.05 97.81,37.05 96.75,35.99 96.75,34.18 97.78,33.15 99.37,33.15 100.15,33.93 100.15,34.85 101.75,34.85 101.75,33.12 101.18,32.55 96.22,32.55 95.5,33.27 95.5,35.81 97.24,37.55
9.VCC_BATT_OUT  (via drill 0.2)
  Top 1.93: 82.95,72.45 85.1,72.45 87.25,70.3 87.25,65.75 v90,63 v90.5,63
  Bottom 0.813: Q1.2 Q1.4 90.4,62.9 | 90.4,62.9 v90.5,63 v91,63 | 90.4,62.9 90.1,62.9 v90,63
  other vias: 82.3,73.75 82.3,74.5 82.3,75.25 45.3,73.95 45.3,74.6 45.3,75.25
  pour Bottom: 85,73.5 80.3,73.5 80.3,75.65 79,75.65 79,77.7 87.1,77.7 87.1,75.9 85,75.9
  pour Top: 83.8,73.5 78.95,73.5 78.95,77.3 83.8,77.3
  pour Bottom: 48,73.5 43.3,73.5 43.3,75.65 42,75.65 42,77.7 50.1,77.7 50.1,75.9 48,75.9
  pour Top: 46.8,73.5 41.95,73.5 41.95,77.3 46.8,77.3
  pour Top: 43.15,74.6 43.15,71.25 83.15,71.25 83.15,74.6
15.HSO_L  (via drill 0.2, 0.2 pad 0.46)
  Top 0.305: U15.18 v5.5,23.65
  Top 0.406: C67.2 v2.25,41.35
  S3 0.61: v2.25,41.35 2.85,41.35 3.15,41.05 3.15,29.55 4.3,28.4 4.3,24 4.65,23.65 v5.5,23.65
17.VCC_1.8  (via drill 0.2, 0.2 pad 0.46)